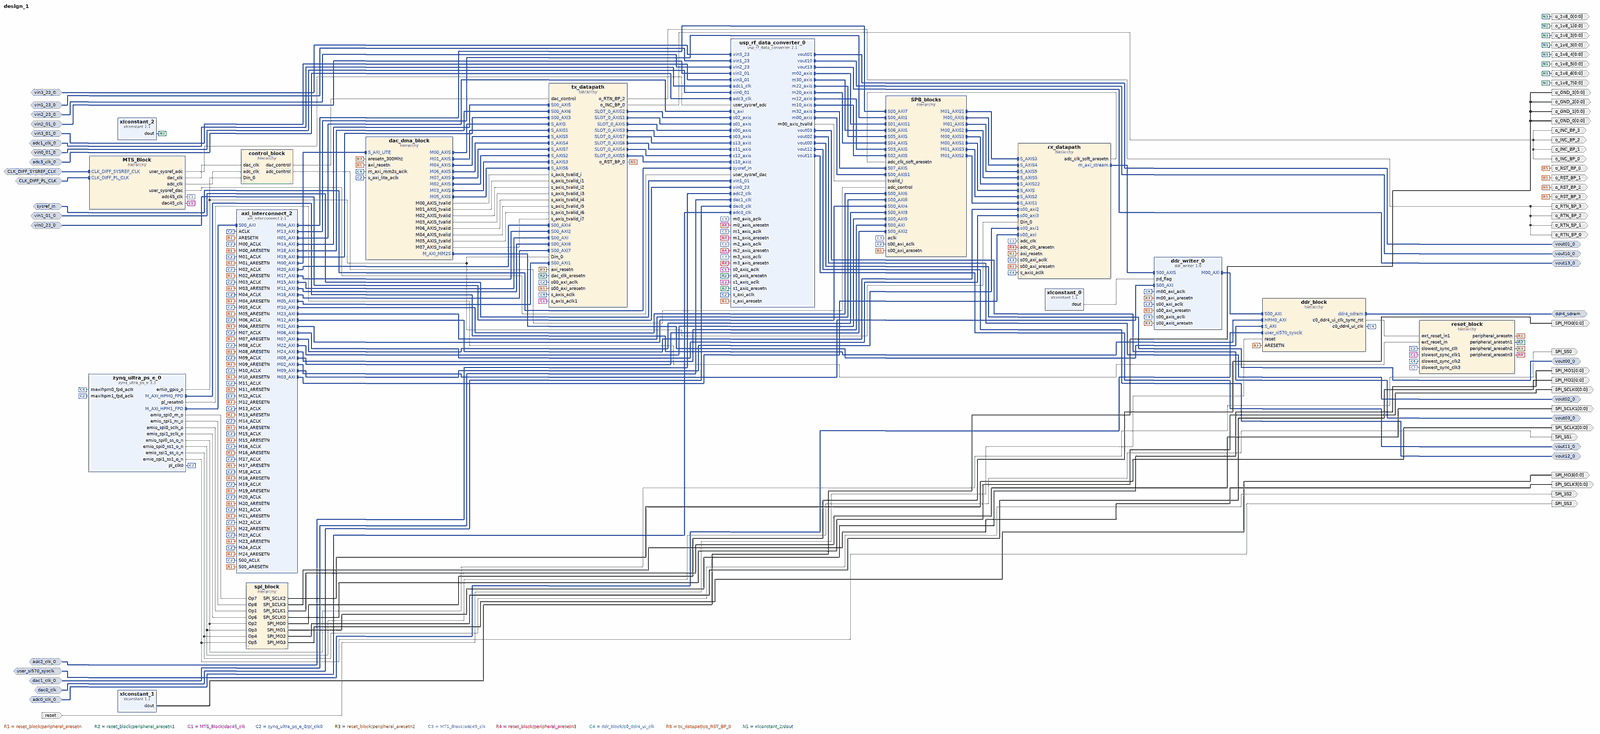
[diagram p0: block diagram of the top level, whole]
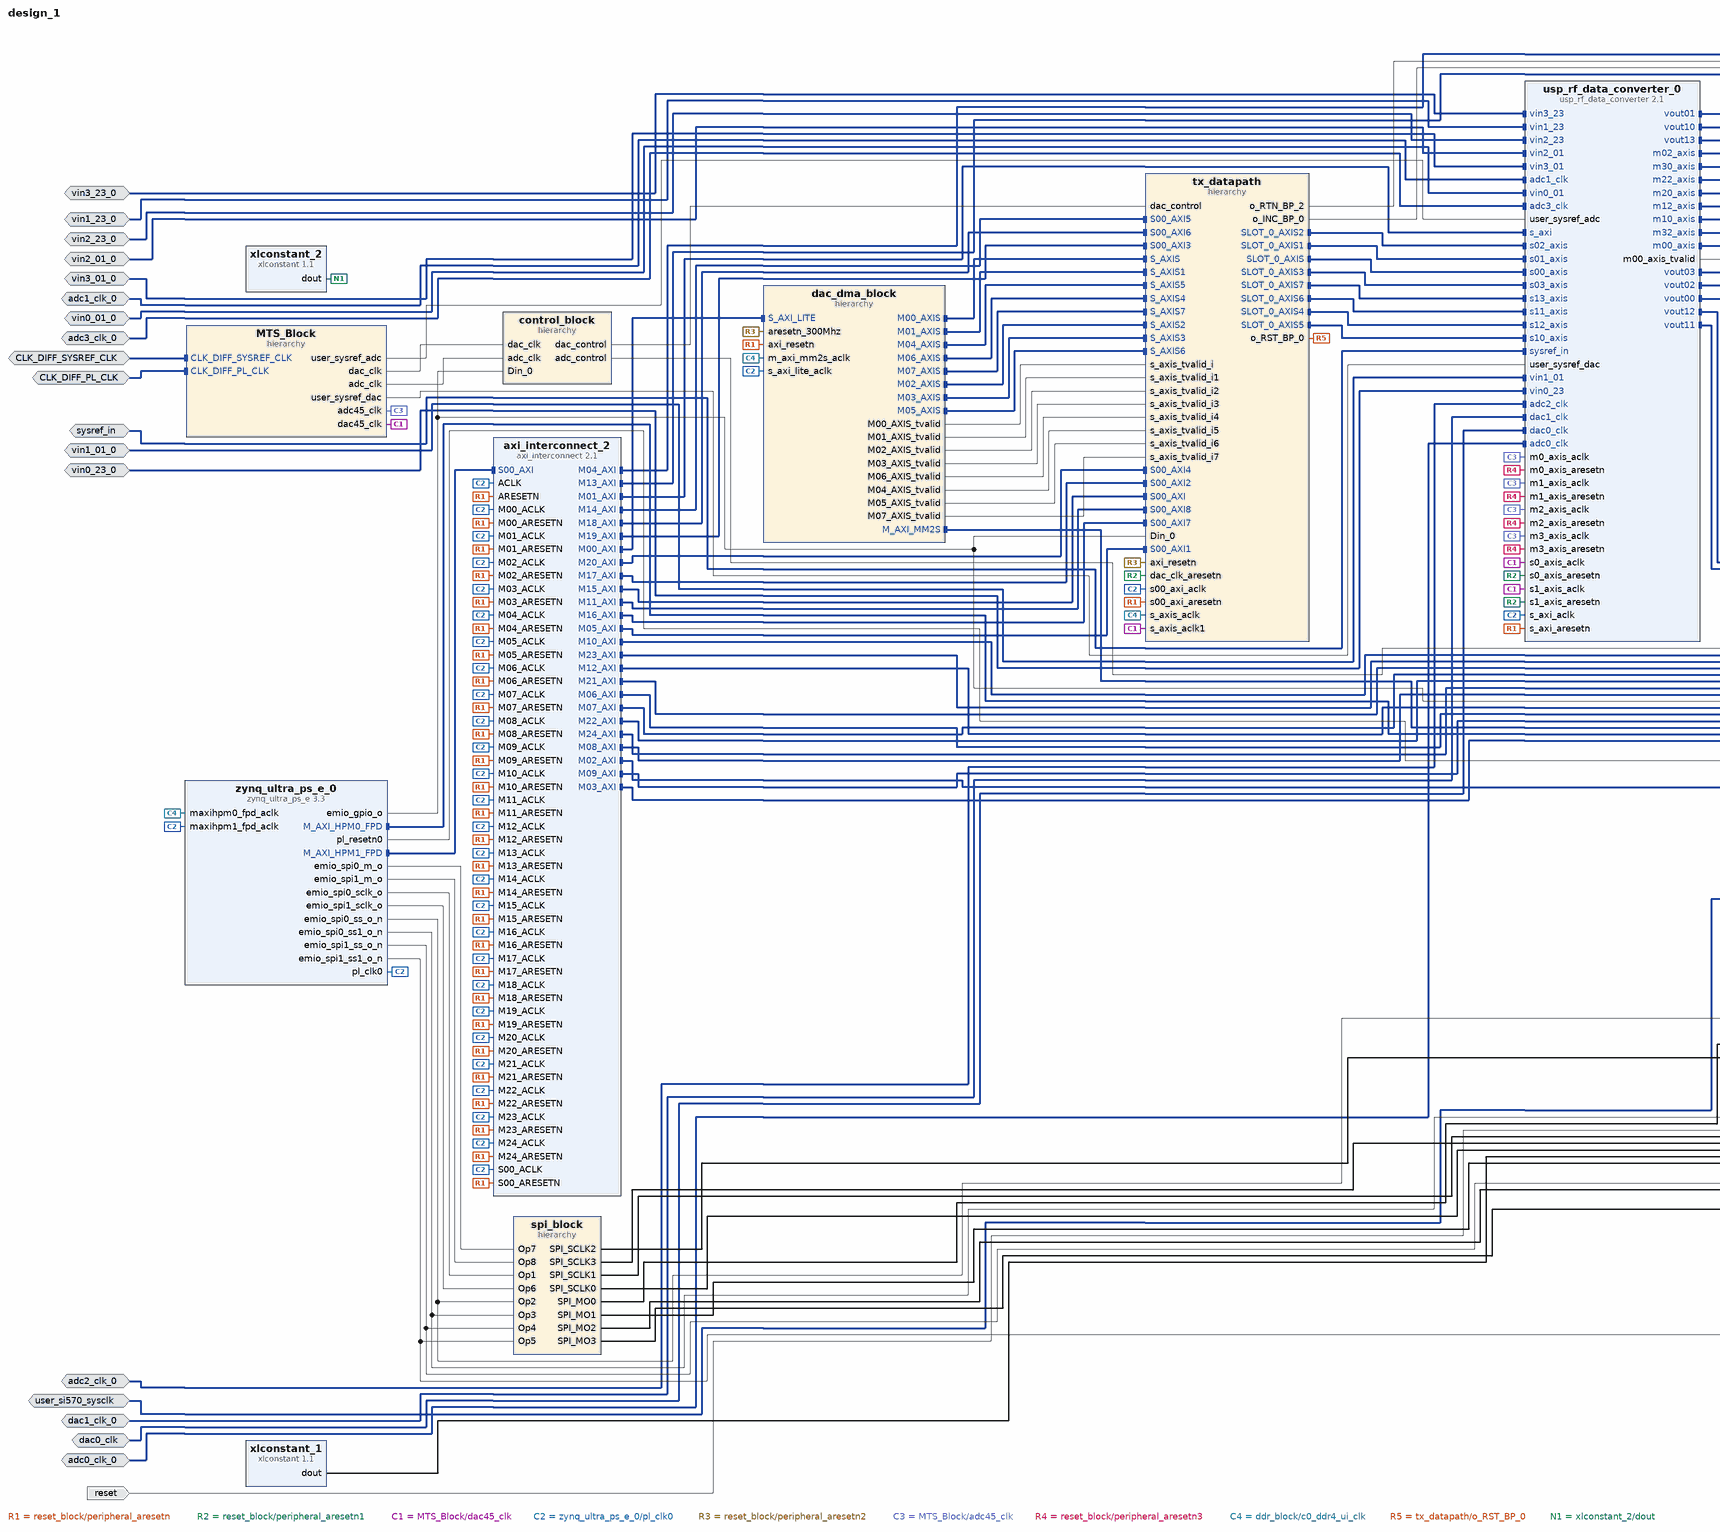
[diagram p1: block diagram of the top level, left part]
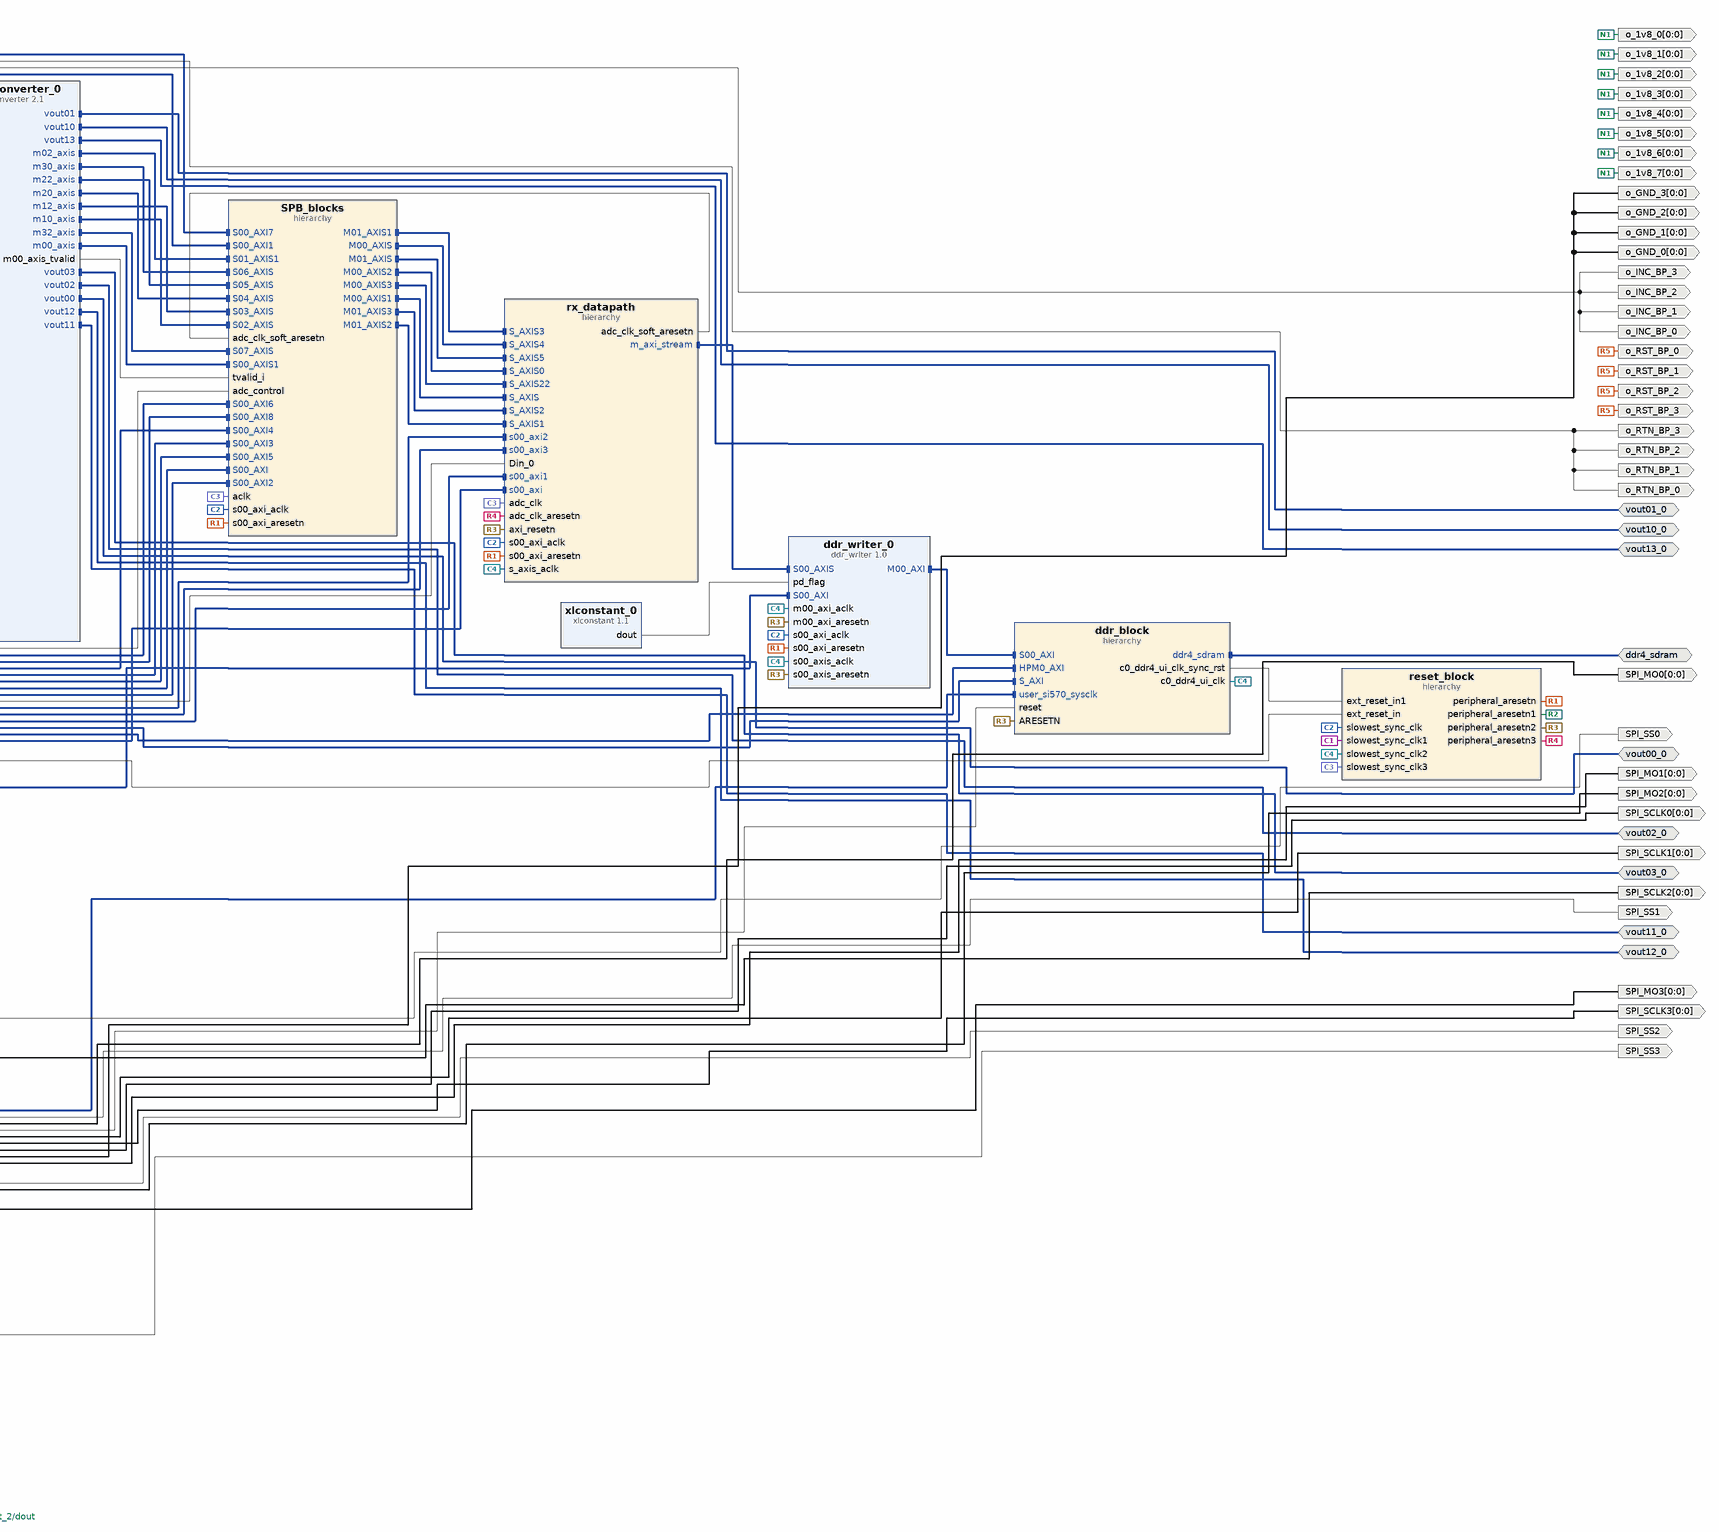
[diagram p2: block diagram of the top level, right part]
# Vivado block design design_1, xczu28dr-ffvg1517-2-e, Vivado 2019.1
create_bd_design design_1

create_bd_intf_port -mode Master -vlnv xilinx.com:interface:diff_analog_io_rtl:1.0 vout00_0
create_bd_intf_port -mode Slave -vlnv xilinx.com:display_usp_rf_data_converter:diff_pins_rtl:1.0 sysref_in
create_bd_intf_port -mode Slave -vlnv xilinx.com:interface:diff_clock_rtl:1.0 dac0_clk
create_bd_intf_port -mode Slave -vlnv xilinx.com:interface:diff_clock_rtl:1.0 CLK_DIFF_PL_CLK
set_property -dict {CONFIG.FREQ_HZ 110000000} [get_bd_intf_ports CLK_DIFF_PL_CLK]
create_bd_intf_port -mode Slave -vlnv xilinx.com:interface:diff_clock_rtl:1.0 user_si570_sysclk
set_property -dict {CONFIG.FREQ_HZ 300000000} [get_bd_intf_ports user_si570_sysclk]
create_bd_intf_port -mode Master -vlnv xilinx.com:interface:ddr4_rtl:1.0 ddr4_sdram
create_bd_intf_port -mode Slave -vlnv xilinx.com:interface:diff_clock_rtl:1.0 CLK_DIFF_SYSREF_CLK
set_property -dict {CONFIG.FREQ_HZ 110000000} [get_bd_intf_ports CLK_DIFF_SYSREF_CLK]
create_bd_intf_port -mode Master -vlnv xilinx.com:interface:diff_analog_io_rtl:1.0 vout01_0
create_bd_intf_port -mode Slave -vlnv xilinx.com:interface:diff_analog_io_rtl:1.0 vin2_01_0
create_bd_intf_port -mode Slave -vlnv xilinx.com:interface:diff_analog_io_rtl:1.0 vin2_23_0
create_bd_intf_port -mode Slave -vlnv xilinx.com:interface:diff_clock_rtl:1.0 adc2_clk_0
create_bd_intf_port -mode Master -vlnv xilinx.com:interface:diff_analog_io_rtl:1.0 vout02_0
create_bd_intf_port -mode Master -vlnv xilinx.com:interface:diff_analog_io_rtl:1.0 vout03_0
create_bd_intf_port -mode Slave -vlnv xilinx.com:interface:diff_analog_io_rtl:1.0 vin3_01_0
create_bd_intf_port -mode Slave -vlnv xilinx.com:interface:diff_analog_io_rtl:1.0 vin3_23_0
create_bd_intf_port -mode Slave -vlnv xilinx.com:interface:diff_clock_rtl:1.0 adc3_clk_0
create_bd_intf_port -mode Slave -vlnv xilinx.com:interface:diff_clock_rtl:1.0 adc0_clk_0
create_bd_intf_port -mode Slave -vlnv xilinx.com:interface:diff_clock_rtl:1.0 adc1_clk_0
create_bd_intf_port -mode Slave -vlnv xilinx.com:interface:diff_clock_rtl:1.0 dac1_clk_0
create_bd_intf_port -mode Slave -vlnv xilinx.com:interface:diff_analog_io_rtl:1.0 vin0_01_0
create_bd_intf_port -mode Slave -vlnv xilinx.com:interface:diff_analog_io_rtl:1.0 vin0_23_0
create_bd_intf_port -mode Slave -vlnv xilinx.com:interface:diff_analog_io_rtl:1.0 vin1_01_0
create_bd_intf_port -mode Slave -vlnv xilinx.com:interface:diff_analog_io_rtl:1.0 vin1_23_0
create_bd_intf_port -mode Master -vlnv xilinx.com:interface:diff_analog_io_rtl:1.0 vout10_0
create_bd_intf_port -mode Master -vlnv xilinx.com:interface:diff_analog_io_rtl:1.0 vout11_0
create_bd_intf_port -mode Master -vlnv xilinx.com:interface:diff_analog_io_rtl:1.0 vout12_0
create_bd_intf_port -mode Master -vlnv xilinx.com:interface:diff_analog_io_rtl:1.0 vout13_0
create_bd_port -dir I -type rst reset
set_property -dict {CONFIG.POLARITY ACTIVE_HIGH} [get_bd_ports reset]
create_bd_port -dir O o_INC_BP_0
create_bd_port -dir O o_RST_BP_0
create_bd_port -dir O o_RTN_BP_0
create_bd_port -dir O o_INC_BP_1
create_bd_port -dir O o_RST_BP_1
create_bd_port -dir O o_RTN_BP_1
create_bd_port -dir O o_INC_BP_2
create_bd_port -dir O o_INC_BP_3
create_bd_port -dir O o_RST_BP_2
create_bd_port -dir O o_RST_BP_3
create_bd_port -dir O o_RTN_BP_2
create_bd_port -dir O o_RTN_BP_3
create_bd_port -dir O -from 0 -to 0 SPI_SCLK0
create_bd_port -dir O -from 0 -to 0 SPI_MO0
create_bd_port -dir O SPI_SS0
create_bd_port -dir O SPI_SS1
create_bd_port -dir O -from 0 -to 0 SPI_SCLK2
create_bd_port -dir O -from 0 -to 0 SPI_MO1
create_bd_port -dir O SPI_SS2
create_bd_port -dir O SPI_SS3
create_bd_port -dir O -from 0 -to 0 SPI_MO2
create_bd_port -dir O -from 0 -to 0 SPI_MO3
create_bd_port -dir O -from 0 -to 0 SPI_SCLK1
create_bd_port -dir O -from 0 -to 0 SPI_SCLK3
create_bd_port -dir O -from 0 -to 0 o_1v8_0
create_bd_port -dir O -from 0 -to 0 o_GND_0
create_bd_port -dir O -from 0 -to 0 o_GND_1
create_bd_port -dir O -from 0 -to 0 o_GND_2
create_bd_port -dir O -from 0 -to 0 o_GND_3
create_bd_port -dir O -from 0 -to 0 o_1v8_3
create_bd_port -dir O -from 0 -to 0 o_1v8_2
create_bd_port -dir O -from 0 -to 0 o_1v8_1
create_bd_port -dir O -from 0 -to 0 o_1v8_4
create_bd_port -dir O -from 0 -to 0 o_1v8_5
create_bd_port -dir O -from 0 -to 0 o_1v8_6
create_bd_port -dir O -from 0 -to 0 o_1v8_7

create_bd_cell -type ip -vlnv xilinx.com:ip:zynq_ultra_ps_e:3.3 zynq_ultra_ps_e_0
set_property -dict [list \
  CONFIG.PSU_BANK_0_IO_STANDARD LVCMOS18 \
  CONFIG.PSU_BANK_1_IO_STANDARD LVCMOS18 \
  CONFIG.PSU_BANK_2_IO_STANDARD LVCMOS18 \
  CONFIG.PSU_USB3__DUAL_CLOCK_ENABLE 1 \
  CONFIG.PSU__CAN1__PERIPHERAL__ENABLE 0 \
  CONFIG.PSU__CRF_APB__ACPU_CTRL__FREQMHZ 1200 \
  CONFIG.PSU__CRF_APB__ACPU_CTRL__SRCSEL APLL \
  CONFIG.PSU__CRF_APB__APLL_CTRL__SRCSEL PSS_REF_CLK \
  CONFIG.PSU__CRF_APB__DBG_FPD_CTRL__FREQMHZ 250 \
  CONFIG.PSU__CRF_APB__DBG_FPD_CTRL__SRCSEL IOPLL \
  CONFIG.PSU__CRF_APB__DBG_TRACE_CTRL__FREQMHZ 250 \
  CONFIG.PSU__CRF_APB__DBG_TRACE_CTRL__SRCSEL IOPLL \
  CONFIG.PSU__CRF_APB__DBG_TSTMP_CTRL__FREQMHZ 250 \
  CONFIG.PSU__CRF_APB__DBG_TSTMP_CTRL__SRCSEL IOPLL \
  CONFIG.PSU__CRF_APB__DDR_CTRL__FREQMHZ 1067 \
  CONFIG.PSU__CRF_APB__DDR_CTRL__SRCSEL DPLL \
  CONFIG.PSU__CRF_APB__DPDMA_REF_CTRL__FREQMHZ 600 \
  CONFIG.PSU__CRF_APB__DPDMA_REF_CTRL__SRCSEL APLL \
  CONFIG.PSU__CRF_APB__DPLL_CTRL__SRCSEL PSS_REF_CLK \
  CONFIG.PSU__CRF_APB__DP_AUDIO_REF_CTRL__SRCSEL RPLL \
  CONFIG.PSU__CRF_APB__DP_STC_REF_CTRL__SRCSEL RPLL \
  CONFIG.PSU__CRF_APB__DP_VIDEO_REF_CTRL__SRCSEL VPLL \
  CONFIG.PSU__CRF_APB__GDMA_REF_CTRL__FREQMHZ 600 \
  CONFIG.PSU__CRF_APB__GDMA_REF_CTRL__SRCSEL APLL \
  CONFIG.PSU__CRF_APB__GPU_REF_CTRL__FREQMHZ 500 \
  CONFIG.PSU__CRF_APB__GPU_REF_CTRL__SRCSEL IOPLL \
  CONFIG.PSU__CRF_APB__TOPSW_LSBUS_CTRL__FREQMHZ 100 \
  CONFIG.PSU__CRF_APB__TOPSW_LSBUS_CTRL__SRCSEL IOPLL \
  CONFIG.PSU__CRF_APB__TOPSW_MAIN_CTRL__FREQMHZ 533.33 \
  CONFIG.PSU__CRF_APB__TOPSW_MAIN_CTRL__SRCSEL DPLL \
  CONFIG.PSU__CRF_APB__VPLL_CTRL__SRCSEL PSS_REF_CLK \
  CONFIG.PSU__CRL_APB__ADMA_REF_CTRL__FREQMHZ 500 \
  CONFIG.PSU__CRL_APB__ADMA_REF_CTRL__SRCSEL IOPLL \
  CONFIG.PSU__CRL_APB__CAN1_REF_CTRL__FREQMHZ 100 \
  CONFIG.PSU__CRL_APB__CAN1_REF_CTRL__SRCSEL IOPLL \
  CONFIG.PSU__CRL_APB__CPU_R5_CTRL__FREQMHZ 500 \
  CONFIG.PSU__CRL_APB__CPU_R5_CTRL__SRCSEL IOPLL \
  CONFIG.PSU__CRL_APB__DBG_LPD_CTRL__FREQMHZ 250 \
  CONFIG.PSU__CRL_APB__DBG_LPD_CTRL__SRCSEL IOPLL \
  CONFIG.PSU__CRL_APB__GEM3_REF_CTRL__FREQMHZ 125 \
  CONFIG.PSU__CRL_APB__GEM3_REF_CTRL__SRCSEL IOPLL \
  CONFIG.PSU__CRL_APB__I2C0_REF_CTRL__FREQMHZ 100 \
  CONFIG.PSU__CRL_APB__I2C0_REF_CTRL__SRCSEL IOPLL \
  CONFIG.PSU__CRL_APB__I2C1_REF_CTRL__FREQMHZ 100 \
  CONFIG.PSU__CRL_APB__I2C1_REF_CTRL__SRCSEL IOPLL \
  CONFIG.PSU__CRL_APB__IOPLL_CTRL__SRCSEL PSS_REF_CLK \
  CONFIG.PSU__CRL_APB__IOU_SWITCH_CTRL__FREQMHZ 250 \
  CONFIG.PSU__CRL_APB__IOU_SWITCH_CTRL__SRCSEL IOPLL \
  CONFIG.PSU__CRL_APB__LPD_LSBUS_CTRL__FREQMHZ 100 \
  CONFIG.PSU__CRL_APB__LPD_LSBUS_CTRL__SRCSEL IOPLL \
  CONFIG.PSU__CRL_APB__LPD_SWITCH_CTRL__FREQMHZ 500 \
  CONFIG.PSU__CRL_APB__LPD_SWITCH_CTRL__SRCSEL IOPLL \
  CONFIG.PSU__CRL_APB__PCAP_CTRL__FREQMHZ 200 \
  CONFIG.PSU__CRL_APB__PCAP_CTRL__SRCSEL IOPLL \
  CONFIG.PSU__CRL_APB__PL0_REF_CTRL__FREQMHZ 100 \
  CONFIG.PSU__CRL_APB__PL0_REF_CTRL__SRCSEL IOPLL \
  CONFIG.PSU__CRL_APB__QSPI_REF_CTRL__FREQMHZ 125 \
  CONFIG.PSU__CRL_APB__QSPI_REF_CTRL__SRCSEL IOPLL \
  CONFIG.PSU__CRL_APB__RPLL_CTRL__SRCSEL PSS_REF_CLK \
  CONFIG.PSU__CRL_APB__SDIO1_REF_CTRL__FREQMHZ 200 \
  CONFIG.PSU__CRL_APB__SDIO1_REF_CTRL__SRCSEL IOPLL \
  CONFIG.PSU__CRL_APB__TIMESTAMP_REF_CTRL__FREQMHZ 100 \
  CONFIG.PSU__CRL_APB__TIMESTAMP_REF_CTRL__SRCSEL IOPLL \
  CONFIG.PSU__CRL_APB__UART0_REF_CTRL__FREQMHZ 100 \
  CONFIG.PSU__CRL_APB__UART0_REF_CTRL__SRCSEL IOPLL \
  CONFIG.PSU__CRL_APB__UART1_REF_CTRL__FREQMHZ 100 \
  CONFIG.PSU__CRL_APB__UART1_REF_CTRL__SRCSEL IOPLL \
  CONFIG.PSU__CRL_APB__USB0_BUS_REF_CTRL__FREQMHZ 250 \
  CONFIG.PSU__CRL_APB__USB0_BUS_REF_CTRL__SRCSEL IOPLL \
  CONFIG.PSU__CRL_APB__USB3_DUAL_REF_CTRL__FREQMHZ 20 \
  CONFIG.PSU__CRL_APB__USB3_DUAL_REF_CTRL__SRCSEL IOPLL \
  CONFIG.PSU__CRL_APB__USB3__ENABLE 1 \
  CONFIG.PSU__CSUPMU__PERIPHERAL__VALID 1 \
  CONFIG.PSU__DDRC__BUS_WIDTH {64 Bit} \
  CONFIG.PSU__DDRC__COMPONENTS UDIMM \
  CONFIG.PSU__DDRC__DEVICE_CAPACITY {8192 MBits} \
  CONFIG.PSU__DDRC__DRAM_WIDTH {16 Bits} \
  CONFIG.PSU__DDRC__ECC Disabled \
  CONFIG.PSU__DDRC__MEMORY_TYPE {DDR 4} \
  CONFIG.PSU__DDRC__SPEED_BIN DDR4_2133P \
  CONFIG.PSU__DDR_HIGH_ADDRESS_GUI_ENABLE 1 \
  CONFIG.PSU__DDR__INTERFACE__FREQMHZ 533.500 \
  CONFIG.PSU__DISPLAYPORT__PERIPHERAL__ENABLE 0 \
  CONFIG.PSU__DLL__ISUSED 1 \
  CONFIG.PSU__ENET3__FIFO__ENABLE 0 \
  CONFIG.PSU__ENET3__GRP_MDIO__ENABLE 1 \
  CONFIG.PSU__ENET3__GRP_MDIO__IO {MIO 76 .. 77} \
  CONFIG.PSU__ENET3__PERIPHERAL__ENABLE 1 \
  CONFIG.PSU__ENET3__PERIPHERAL__IO {MIO 64 .. 75} \
  CONFIG.PSU__ENET3__PTP__ENABLE 0 \
  CONFIG.PSU__ENET3__TSU__ENABLE 0 \
  CONFIG.PSU__FPGA_PL0_ENABLE 1 \
  CONFIG.PSU__GEM3_COHERENCY 0 \
  CONFIG.PSU__GEM3_ROUTE_THROUGH_FPD 0 \
  CONFIG.PSU__GEM__TSU__ENABLE 0 \
  CONFIG.PSU__GPIO0_MIO__IO {MIO 0 .. 25} \
  CONFIG.PSU__GPIO0_MIO__PERIPHERAL__ENABLE 1 \
  CONFIG.PSU__GPIO1_MIO__IO {MIO 26 .. 51} \
  CONFIG.PSU__GPIO1_MIO__PERIPHERAL__ENABLE 1 \
  CONFIG.PSU__GPIO_EMIO_WIDTH 95 \
  CONFIG.PSU__GPIO_EMIO__PERIPHERAL__ENABLE 1 \
  CONFIG.PSU__GPIO_EMIO__PERIPHERAL__IO 95 \
  CONFIG.PSU__I2C0__PERIPHERAL__ENABLE 1 \
  CONFIG.PSU__I2C0__PERIPHERAL__IO {MIO 14 .. 15} \
  CONFIG.PSU__I2C1__PERIPHERAL__ENABLE 1 \
  CONFIG.PSU__I2C1__PERIPHERAL__IO {MIO 16 .. 17} \
  CONFIG.PSU__IOU_SLCR__IOU_TTC_APB_CLK__TTC0_SEL APB \
  CONFIG.PSU__IOU_SLCR__IOU_TTC_APB_CLK__TTC1_SEL APB \
  CONFIG.PSU__IOU_SLCR__IOU_TTC_APB_CLK__TTC2_SEL APB \
  CONFIG.PSU__IOU_SLCR__IOU_TTC_APB_CLK__TTC3_SEL APB \
  CONFIG.PSU__MAXIGP0__DATA_WIDTH 128 \
  CONFIG.PSU__OVERRIDE__BASIC_CLOCK 0 \
  CONFIG.PSU__PMU_COHERENCY 0 \
  CONFIG.PSU__PMU__AIBACK__ENABLE 0 \
  CONFIG.PSU__PMU__EMIO_GPI__ENABLE 0 \
  CONFIG.PSU__PMU__EMIO_GPO__ENABLE 0 \
  CONFIG.PSU__PMU__GPI0__ENABLE 0 \
  CONFIG.PSU__PMU__GPI1__ENABLE 0 \
  CONFIG.PSU__PMU__GPI2__ENABLE 0 \
  CONFIG.PSU__PMU__GPI3__ENABLE 0 \
  CONFIG.PSU__PMU__GPI4__ENABLE 0 \
  CONFIG.PSU__PMU__GPI5__ENABLE 0 \
  CONFIG.PSU__PMU__GPO0__ENABLE 0 \
  CONFIG.PSU__PMU__GPO1__ENABLE 0 \
  CONFIG.PSU__PMU__GPO2__ENABLE 0 \
  CONFIG.PSU__PMU__GPO3__ENABLE 0 \
  CONFIG.PSU__PMU__GPO4__ENABLE 0 \
  CONFIG.PSU__PMU__GPO5__ENABLE 0 \
  CONFIG.PSU__PMU__PERIPHERAL__ENABLE 1 \
  CONFIG.PSU__PMU__PLERROR__ENABLE 0 \
  CONFIG.PSU__PRESET_APPLIED 1 \
  CONFIG.PSU__PSS_REF_CLK__FREQMHZ 33.333 \
  CONFIG.PSU__QSPI_COHERENCY 0 \
  CONFIG.PSU__QSPI_ROUTE_THROUGH_FPD 0 \
  CONFIG.PSU__QSPI__GRP_FBCLK__ENABLE 1 \
  CONFIG.PSU__QSPI__GRP_FBCLK__IO {MIO 6} \
  CONFIG.PSU__QSPI__PERIPHERAL__DATA_MODE x4 \
  CONFIG.PSU__QSPI__PERIPHERAL__ENABLE 1 \
  CONFIG.PSU__QSPI__PERIPHERAL__IO {MIO 0 .. 12} \
  CONFIG.PSU__QSPI__PERIPHERAL__MODE {Dual Parallel} \
  CONFIG.PSU__SATA__PERIPHERAL__ENABLE 0 \
  CONFIG.PSU__SD1_COHERENCY 0 \
  CONFIG.PSU__SD1_ROUTE_THROUGH_FPD 0 \
  CONFIG.PSU__SD1__DATA_TRANSFER_MODE 8Bit \
  CONFIG.PSU__SD1__GRP_CD__ENABLE 1 \
  CONFIG.PSU__SD1__GRP_CD__IO {MIO 45} \
  CONFIG.PSU__SD1__GRP_POW__ENABLE 0 \
  CONFIG.PSU__SD1__GRP_WP__ENABLE 0 \
  CONFIG.PSU__SD1__PERIPHERAL__ENABLE 1 \
  CONFIG.PSU__SD1__PERIPHERAL__IO {MIO 39 .. 51} \
  CONFIG.PSU__SD1__SLOT_TYPE {SD 3.0} \
  CONFIG.PSU__SPI0__GRP_SS0__IO EMIO \
  CONFIG.PSU__SPI0__GRP_SS1__ENABLE 1 \
  CONFIG.PSU__SPI0__GRP_SS1__IO EMIO \
  CONFIG.PSU__SPI0__PERIPHERAL__ENABLE 1 \
  CONFIG.PSU__SPI0__PERIPHERAL__IO EMIO \
  CONFIG.PSU__SPI1__GRP_SS0__IO EMIO \
  CONFIG.PSU__SPI1__GRP_SS1__ENABLE 1 \
  CONFIG.PSU__SPI1__GRP_SS1__IO EMIO \
  CONFIG.PSU__SPI1__PERIPHERAL__ENABLE 1 \
  CONFIG.PSU__SPI1__PERIPHERAL__IO EMIO \
  CONFIG.PSU__SWDT0__CLOCK__ENABLE 0 \
  CONFIG.PSU__SWDT0__PERIPHERAL__ENABLE 1 \
  CONFIG.PSU__SWDT0__RESET__ENABLE 0 \
  CONFIG.PSU__SWDT1__CLOCK__ENABLE 0 \
  CONFIG.PSU__SWDT1__PERIPHERAL__ENABLE 1 \
  CONFIG.PSU__SWDT1__RESET__ENABLE 0 \
  CONFIG.PSU__TSU__BUFG_PORT_PAIR 0 \
  CONFIG.PSU__TTC0__CLOCK__ENABLE 0 \
  CONFIG.PSU__TTC0__PERIPHERAL__ENABLE 1 \
  CONFIG.PSU__TTC0__WAVEOUT__ENABLE 0 \
  CONFIG.PSU__TTC1__CLOCK__ENABLE 0 \
  CONFIG.PSU__TTC1__PERIPHERAL__ENABLE 1 \
  CONFIG.PSU__TTC1__WAVEOUT__ENABLE 0 \
  CONFIG.PSU__TTC2__CLOCK__ENABLE 0 \
  CONFIG.PSU__TTC2__PERIPHERAL__ENABLE 1 \
  CONFIG.PSU__TTC2__WAVEOUT__ENABLE 0 \
  CONFIG.PSU__TTC3__CLOCK__ENABLE 0 \
  CONFIG.PSU__TTC3__PERIPHERAL__ENABLE 1 \
  CONFIG.PSU__TTC3__WAVEOUT__ENABLE 0 \
  CONFIG.PSU__UART0__BAUD_RATE 115200 \
  CONFIG.PSU__UART0__MODEM__ENABLE 0 \
  CONFIG.PSU__UART0__PERIPHERAL__ENABLE 1 \
  CONFIG.PSU__UART0__PERIPHERAL__IO {MIO 18 .. 19} \
  CONFIG.PSU__UART1__PERIPHERAL__ENABLE 0 \
  CONFIG.PSU__USB0_COHERENCY 0 \
  CONFIG.PSU__USB0__PERIPHERAL__ENABLE 1 \
  CONFIG.PSU__USB0__PERIPHERAL__IO {MIO 52 .. 63} \
  CONFIG.PSU__USB0__REF_CLK_FREQ 26 \
  CONFIG.PSU__USB0__REF_CLK_SEL {Ref Clk2} \
  CONFIG.PSU__USB2_0__EMIO__ENABLE 0 \
  CONFIG.PSU__USB3_0__EMIO__ENABLE 0 \
  CONFIG.PSU__USB3_0__PERIPHERAL__ENABLE 1 \
  CONFIG.PSU__USB3_0__PERIPHERAL__IO {GT Lane2} \
  CONFIG.PSU__USB__RESET__MODE {Boot Pin} \
  CONFIG.PSU__USB__RESET__POLARITY {Active Low} \
  CONFIG.PSU__USE__IRQ0 1 \
  CONFIG.PSU__USE__M_AXI_GP0 1 \
  CONFIG.PSU__USE__M_AXI_GP1 1 \
  CONFIG.PSU__USE__M_AXI_GP2 0 \
  CONFIG.SUBPRESET1 Custom \
] [get_bd_cells zynq_ultra_ps_e_0]
# 123 more settings of zynq_ultra_ps_e_0 are not shown: defaults, MIO pin electricals, DDR timing, and values the tool derives
create_bd_cell -type hier MTS_Block
create_bd_cell -type hier reset_block
create_bd_cell -type hier dac_dma_block
create_bd_cell -type hier ddr_block
create_bd_cell -type ip -vlnv xilinx.com:ip:usp_rf_data_converter:2.1 usp_rf_data_converter_0
set_property -dict [list \
  CONFIG.ADC0_Multi_Tile_Sync true \
  CONFIG.ADC0_Outclk_Freq 27.500 \
  CONFIG.ADC0_Refclk_Freq 3520.000 \
  CONFIG.ADC0_Sampling_Rate 3.520 \
  CONFIG.ADC1_Multi_Tile_Sync true \
  CONFIG.ADC1_Outclk_Freq 27.500 \
  CONFIG.ADC1_Refclk_Freq 3520.000 \
  CONFIG.ADC1_Sampling_Rate 3.520 \
  CONFIG.ADC2_Multi_Tile_Sync true \
  CONFIG.ADC2_Outclk_Freq 27.500 \
  CONFIG.ADC2_Refclk_Freq 3520.000 \
  CONFIG.ADC2_Sampling_Rate 3.520 \
  CONFIG.ADC3_Multi_Tile_Sync true \
  CONFIG.ADC3_Outclk_Freq 27.500 \
  CONFIG.ADC3_Refclk_Freq 3520.000 \
  CONFIG.ADC3_Sampling_Rate 3.520 \
  CONFIG.ADC_Decimation_Mode00 1 \
  CONFIG.ADC_Decimation_Mode02 1 \
  CONFIG.ADC_Decimation_Mode10 1 \
  CONFIG.ADC_Decimation_Mode12 1 \
  CONFIG.ADC_Decimation_Mode20 1 \
  CONFIG.ADC_Decimation_Mode22 1 \
  CONFIG.ADC_Decimation_Mode30 1 \
  CONFIG.ADC_Decimation_Mode32 1 \
  CONFIG.ADC_Mixer_Type00 0 \
  CONFIG.ADC_Mixer_Type01 0 \
  CONFIG.ADC_Mixer_Type02 0 \
  CONFIG.ADC_Mixer_Type03 0 \
  CONFIG.ADC_Mixer_Type10 0 \
  CONFIG.ADC_Mixer_Type11 0 \
  CONFIG.ADC_Mixer_Type12 0 \
  CONFIG.ADC_Mixer_Type13 0 \
  CONFIG.ADC_Mixer_Type20 0 \
  CONFIG.ADC_Mixer_Type21 0 \
  CONFIG.ADC_Mixer_Type22 0 \
  CONFIG.ADC_Mixer_Type23 0 \
  CONFIG.ADC_Mixer_Type30 0 \
  CONFIG.ADC_Mixer_Type31 0 \
  CONFIG.ADC_Mixer_Type32 0 \
  CONFIG.ADC_Mixer_Type33 0 \
  CONFIG.ADC_Slice00_Enable true \
  CONFIG.ADC_Slice02_Enable true \
  CONFIG.ADC_Slice10_Enable true \
  CONFIG.ADC_Slice12_Enable true \
  CONFIG.ADC_Slice20_Enable true \
  CONFIG.ADC_Slice22_Enable true \
  CONFIG.ADC_Slice30_Enable true \
  CONFIG.ADC_Slice32_Enable true \
  CONFIG.DAC0_Multi_Tile_Sync true \
  CONFIG.DAC0_Outclk_Freq 220.000 \
  CONFIG.DAC0_Refclk_Freq 3520.000 \
  CONFIG.DAC0_Sampling_Rate 3.520 \
  CONFIG.DAC1_Multi_Tile_Sync true \
  CONFIG.DAC1_Outclk_Freq 220.000 \
  CONFIG.DAC1_Refclk_Freq 3520.000 \
  CONFIG.DAC1_Sampling_Rate 3.520 \
  CONFIG.DAC_Interpolation_Mode00 1 \
  CONFIG.DAC_Interpolation_Mode01 1 \
  CONFIG.DAC_Interpolation_Mode02 1 \
  CONFIG.DAC_Interpolation_Mode03 1 \
  CONFIG.DAC_Interpolation_Mode10 1 \
  CONFIG.DAC_Interpolation_Mode11 1 \
  CONFIG.DAC_Interpolation_Mode12 1 \
  CONFIG.DAC_Interpolation_Mode13 1 \
  CONFIG.DAC_Mixer_Type00 0 \
  CONFIG.DAC_Mixer_Type01 0 \
  CONFIG.DAC_Mixer_Type02 0 \
  CONFIG.DAC_Mixer_Type03 0 \
  CONFIG.DAC_Mixer_Type10 0 \
  CONFIG.DAC_Mixer_Type11 0 \
  CONFIG.DAC_Mixer_Type12 0 \
  CONFIG.DAC_Mixer_Type13 0 \
  CONFIG.DAC_Slice00_Enable true \
  CONFIG.DAC_Slice01_Enable true \
  CONFIG.DAC_Slice02_Enable true \
  CONFIG.DAC_Slice03_Enable true \
  CONFIG.DAC_Slice10_Enable true \
  CONFIG.DAC_Slice11_Enable true \
  CONFIG.DAC_Slice12_Enable true \
  CONFIG.DAC_Slice13_Enable true \
] [get_bd_cells usp_rf_data_converter_0]
create_bd_cell -type hier control_block
create_bd_cell -type ip -vlnv xilinx.com:ip:axi_interconnect:2.1 axi_interconnect_2
set_property -dict {CONFIG.NUM_MI 25} [get_bd_cells axi_interconnect_2]
create_bd_cell -type ip -vlnv xilinx.com:ip:xlconstant:1.1 xlconstant_0
set_property -dict {CONFIG.CONST_VAL 0} [get_bd_cells xlconstant_0]
create_bd_cell -type hier SPB_blocks
create_bd_cell -type hier rx_datapath
create_bd_cell -type hier tx_datapath
create_bd_cell -type ip -vlnv user.org:user:ddr_writer:1.0 ddr_writer_0
set_property -dict [list \
  CONFIG.C_M00_AXI_ADDR_WIDTH 64 \
  CONFIG.C_M00_AXI_ID_WIDTH 3 \
  CONFIG.C_M00_AXI_TARGET_SLAVE_BASE_ADDR 0x400010000 \
] [get_bd_cells ddr_writer_0]
create_bd_cell -type ip -vlnv xilinx.com:ip:xlconstant:1.1 xlconstant_1
set_property -dict {CONFIG.CONST_VAL 0} [get_bd_cells xlconstant_1]
create_bd_cell -type ip -vlnv xilinx.com:ip:xlconstant:1.1 xlconstant_2
create_bd_cell -type hier spi_block

# ---- hierarchy /MTS_Block ----
current_bd_instance /MTS_Block
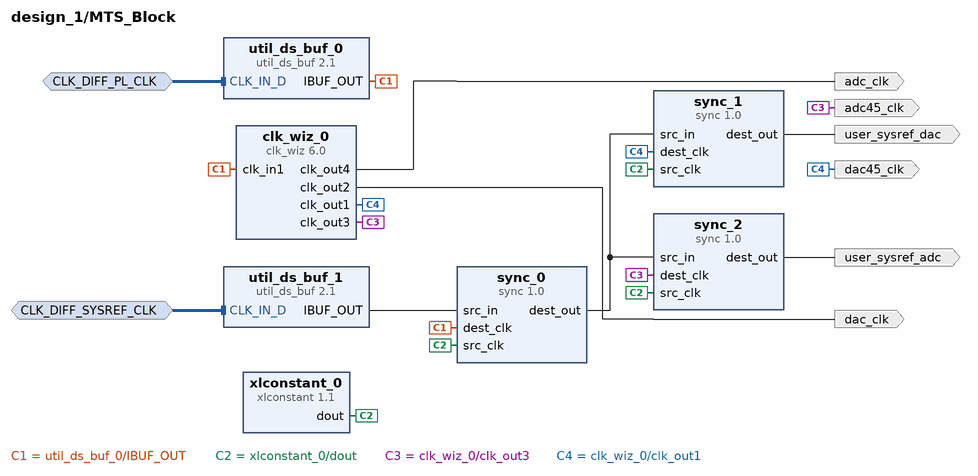
[diagram p3: block diagram inside /MTS_Block]
create_bd_intf_pin -mode Slave -vlnv xilinx.com:interface:diff_clock_rtl:1.0 CLK_DIFF_PL_CLK
create_bd_intf_pin -mode Slave -vlnv xilinx.com:interface:diff_clock_rtl:1.0 CLK_DIFF_SYSREF_CLK
create_bd_pin -dir O dac45_clk
create_bd_pin -dir O dac_clk
create_bd_pin -dir O user_sysref_dac
create_bd_pin -dir O user_sysref_adc
create_bd_pin -dir O adc45_clk
create_bd_pin -dir O adc_clk

create_bd_cell -type ip -vlnv xilinx.com:ip:util_ds_buf:2.1 util_ds_buf_0
create_bd_cell -type ip -vlnv xilinx.com:ip:clk_wiz:6.0 clk_wiz_0
set_property -dict [list \
  CONFIG.CLKIN1_JITTER_PS 90.89999999999999 \
  CONFIG.CLKOUT1_DRIVES Buffer \
  CONFIG.CLKOUT1_JITTER 116.681 \
  CONFIG.CLKOUT1_PHASE_ERROR 106.355 \
  CONFIG.CLKOUT1_REQUESTED_OUT_FREQ 220.000 \
  CONFIG.CLKOUT1_REQUESTED_PHASE 22.5 \
  CONFIG.CLKOUT2_DRIVES Buffer \
  CONFIG.CLKOUT2_JITTER 116.681 \
  CONFIG.CLKOUT2_PHASE_ERROR 106.355 \
  CONFIG.CLKOUT2_REQUESTED_OUT_FREQ 220.000 \
  CONFIG.CLKOUT2_REQUESTED_PHASE 0 \
  CONFIG.CLKOUT2_USED true \
  CONFIG.CLKOUT3_DRIVES Buffer \
  CONFIG.CLKOUT3_JITTER 102.539 \
  CONFIG.CLKOUT3_PHASE_ERROR 106.355 \
  CONFIG.CLKOUT3_REQUESTED_OUT_FREQ 440.000 \
  CONFIG.CLKOUT3_REQUESTED_PHASE 22.5 \
  CONFIG.CLKOUT3_USED true \
  CONFIG.CLKOUT4_DRIVES Buffer \
  CONFIG.CLKOUT4_JITTER 102.539 \
  CONFIG.CLKOUT4_PHASE_ERROR 106.355 \
  CONFIG.CLKOUT4_REQUESTED_OUT_FREQ 440.000 \
  CONFIG.CLKOUT4_USED true \
  CONFIG.CLKOUT5_DRIVES Buffer \
  CONFIG.CLKOUT6_DRIVES Buffer \
  CONFIG.CLKOUT7_DRIVES Buffer \
  CONFIG.ENABLE_CLOCK_MONITOR false \
  CONFIG.MMCM_CLKFBOUT_MULT_F 8.000 \
  CONFIG.MMCM_CLKIN1_PERIOD 9.091 \
  CONFIG.MMCM_CLKIN2_PERIOD 10.0 \
  CONFIG.MMCM_CLKOUT0_DIVIDE_F 4.000 \
  CONFIG.MMCM_CLKOUT0_PHASE 22.500 \
  CONFIG.MMCM_CLKOUT1_DIVIDE 4 \
  CONFIG.MMCM_CLKOUT1_PHASE 0.000 \
  CONFIG.MMCM_CLKOUT2_DIVIDE 2 \
  CONFIG.MMCM_CLKOUT2_PHASE 22.500 \
  CONFIG.MMCM_CLKOUT3_DIVIDE 2 \
  CONFIG.MMCM_DIVCLK_DIVIDE 1 \
  CONFIG.NUM_OUT_CLKS 4 \
  CONFIG.PRIMITIVE MMCM \
  CONFIG.PRIM_IN_FREQ 110.000 \
  CONFIG.SECONDARY_SOURCE Single_ended_clock_capable_pin \
  CONFIG.USE_LOCKED false \
  CONFIG.USE_PHASE_ALIGNMENT false \
  CONFIG.USE_RESET false \
] [get_bd_cells clk_wiz_0]
create_bd_cell -type ip -vlnv xilinx.com:ip:util_ds_buf:2.1 util_ds_buf_1
create_bd_cell -type ip -vlnv xilinx.com:user:sync:1.0 sync_0
set_property -dict {CONFIG.DEST_SYNC_FF 2 CONFIG.SRC_INPUT_REG 0} [get_bd_cells sync_0]
create_bd_cell -type ip -vlnv xilinx.com:user:sync:1.0 sync_1
set_property -dict {CONFIG.DEST_SYNC_FF 2 CONFIG.SRC_INPUT_REG 0} [get_bd_cells sync_1]
create_bd_cell -type ip -vlnv xilinx.com:ip:xlconstant:1.1 xlconstant_0
set_property -dict {CONFIG.CONST_VAL 0} [get_bd_cells xlconstant_0]
create_bd_cell -type ip -vlnv xilinx.com:user:sync:1.0 sync_2
set_property -dict {CONFIG.DEST_SYNC_FF 2 CONFIG.SRC_INPUT_REG 0} [get_bd_cells sync_2]

# ---- hierarchy /reset_block ----
current_bd_instance /reset_block
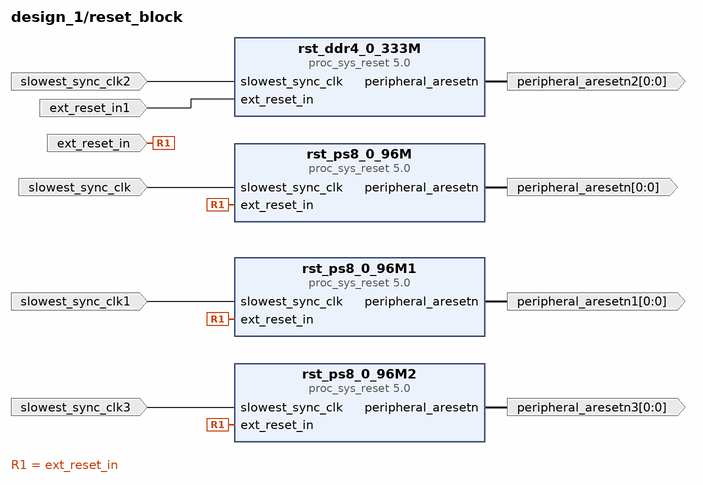
[diagram p4: block diagram inside /reset_block]
create_bd_pin -dir I -type clk slowest_sync_clk
create_bd_pin -dir I -type rst ext_reset_in
create_bd_pin -dir O -from 0 -to 0 -type rst peripheral_aresetn
create_bd_pin -dir I -type clk slowest_sync_clk1
create_bd_pin -dir O -from 0 -to 0 -type rst peripheral_aresetn1
create_bd_pin -dir O -from 0 -to 0 -type rst peripheral_aresetn2
create_bd_pin -dir I -type clk slowest_sync_clk2
create_bd_pin -dir I -type rst ext_reset_in1
create_bd_pin -dir O -from 0 -to 0 -type rst peripheral_aresetn3
create_bd_pin -dir I -type clk slowest_sync_clk3

create_bd_cell -type ip -vlnv xilinx.com:ip:proc_sys_reset:5.0 rst_ps8_0_96M
create_bd_cell -type ip -vlnv xilinx.com:ip:proc_sys_reset:5.0 rst_ps8_0_96M1
create_bd_cell -type ip -vlnv xilinx.com:ip:proc_sys_reset:5.0 rst_ddr4_0_333M
create_bd_cell -type ip -vlnv xilinx.com:ip:proc_sys_reset:5.0 rst_ps8_0_96M2

# ---- hierarchy /dac_dma_block ----
current_bd_instance /dac_dma_block
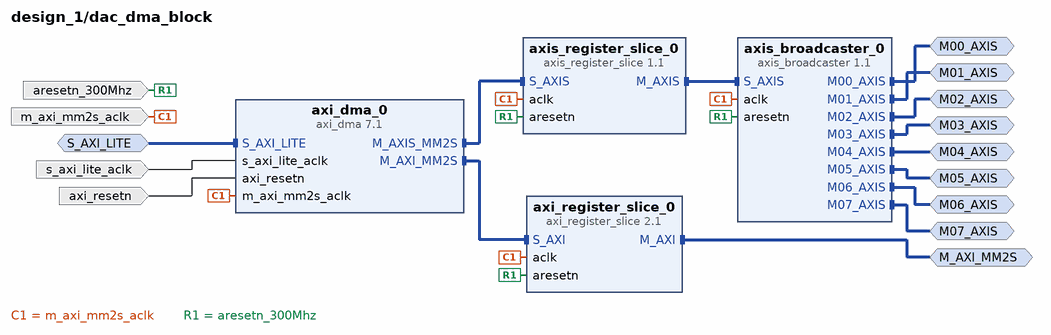
[diagram p5: block diagram inside /dac_dma_block]
create_bd_intf_pin -mode Slave -vlnv xilinx.com:interface:aximm_rtl:1.0 S_AXI_LITE
create_bd_intf_pin -mode Master -vlnv xilinx.com:interface:axis_rtl:1.0 M00_AXIS
create_bd_intf_pin -mode Master -vlnv xilinx.com:interface:axis_rtl:1.0 M01_AXIS
create_bd_intf_pin -mode Master -vlnv xilinx.com:interface:axis_rtl:1.0 M02_AXIS
create_bd_intf_pin -mode Master -vlnv xilinx.com:interface:axis_rtl:1.0 M03_AXIS
create_bd_intf_pin -mode Master -vlnv xilinx.com:interface:aximm_rtl:1.0 M_AXI_MM2S
create_bd_intf_pin -mode Master -vlnv xilinx.com:interface:axis_rtl:1.0 M04_AXIS
create_bd_intf_pin -mode Master -vlnv xilinx.com:interface:axis_rtl:1.0 M05_AXIS
create_bd_intf_pin -mode Master -vlnv xilinx.com:interface:axis_rtl:1.0 M06_AXIS
create_bd_intf_pin -mode Master -vlnv xilinx.com:interface:axis_rtl:1.0 M07_AXIS
create_bd_pin -dir I -type clk s_axi_lite_aclk
create_bd_pin -dir I -type clk m_axi_mm2s_aclk
create_bd_pin -dir I -type rst axi_resetn
create_bd_pin -dir I -type rst aresetn_300Mhz

create_bd_cell -type ip -vlnv xilinx.com:ip:axi_dma:7.1 axi_dma_0
set_property -dict [list \
  CONFIG.c_addr_width 64 \
  CONFIG.c_include_mm2s_dre 1 \
  CONFIG.c_include_s2mm 0 \
  CONFIG.c_include_sg 0 \
  CONFIG.c_m_axi_mm2s_data_width 512 \
  CONFIG.c_m_axis_mm2s_tdata_width 256 \
  CONFIG.c_mm2s_burst_size 64 \
  CONFIG.c_sg_length_width 26 \
] [get_bd_cells axi_dma_0]
create_bd_cell -type ip -vlnv xilinx.com:ip:axis_broadcaster:1.1 axis_broadcaster_0
set_property -dict [list \
  CONFIG.M02_TDATA_REMAP {tdata[255:0]} \
  CONFIG.M03_TDATA_REMAP {tdata[255:0]} \
  CONFIG.M04_TDATA_REMAP {tdata[255:0]} \
  CONFIG.M05_TDATA_REMAP {tdata[255:0]} \
  CONFIG.M06_TDATA_REMAP {tdata[255:0]} \
  CONFIG.M07_TDATA_REMAP {tdata[255:0]} \
  CONFIG.NUM_MI 8 \
] [get_bd_cells axis_broadcaster_0]
create_bd_cell -type ip -vlnv xilinx.com:ip:axi_register_slice:2.1 axi_register_slice_0
create_bd_cell -type ip -vlnv xilinx.com:ip:axis_register_slice:1.1 axis_register_slice_0

# ---- hierarchy /ddr_block ----
current_bd_instance /ddr_block
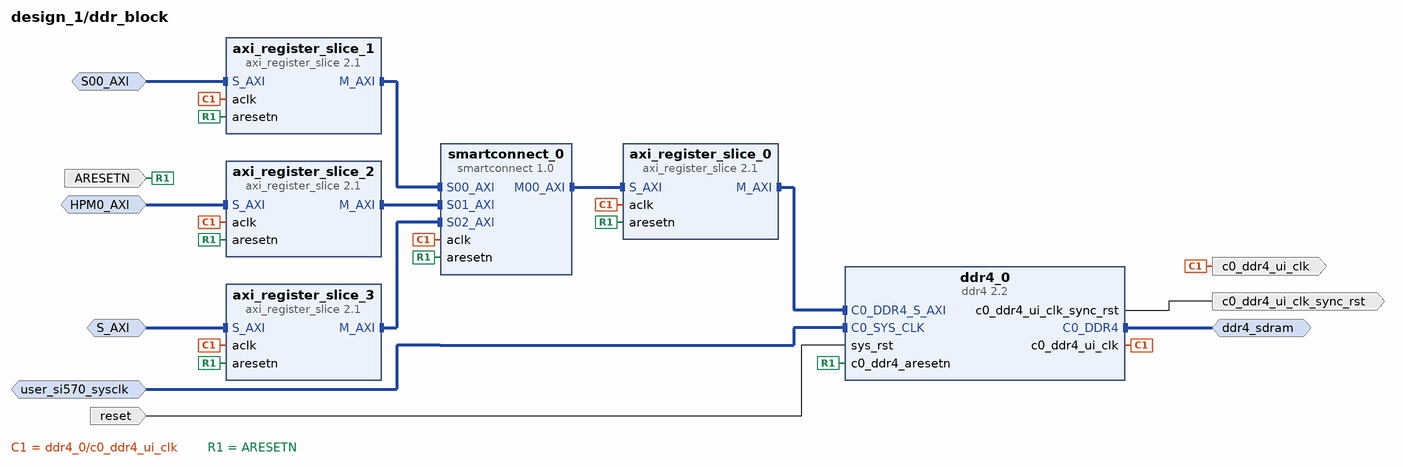
[diagram p6: block diagram inside /ddr_block]
create_bd_intf_pin -mode Slave -vlnv xilinx.com:interface:diff_clock_rtl:1.0 user_si570_sysclk
create_bd_intf_pin -mode Master -vlnv xilinx.com:interface:ddr4_rtl:1.0 ddr4_sdram
create_bd_intf_pin -mode Slave -vlnv xilinx.com:interface:aximm_rtl:1.0 S00_AXI
create_bd_intf_pin -mode Slave -vlnv xilinx.com:interface:aximm_rtl:1.0 HPM0_AXI
create_bd_intf_pin -mode Slave -vlnv xilinx.com:interface:aximm_rtl:1.0 S_AXI
create_bd_pin -dir O -type clk c0_ddr4_ui_clk
create_bd_pin -dir I -type rst ARESETN
create_bd_pin -dir O -type rst c0_ddr4_ui_clk_sync_rst
create_bd_pin -dir I -type rst reset

create_bd_cell -type ip -vlnv xilinx.com:ip:ddr4:2.2 ddr4_0
set_property -dict [list \
  CONFIG.C0.DDR4_AUTO_AP_COL_A3 false \
  CONFIG.C0.DDR4_AxiArbitrationScheme RD_PRI_REG \
  CONFIG.C0.DDR4_Mem_Add_Map ROW_COLUMN_BANK \
  CONFIG.C0.DDR4_SAVE_RESTORE false \
  CONFIG.C0.DDR4_SELF_REFRESH false \
  CONFIG.C0.DDR4_UserRefresh_ZQCS false \
  CONFIG.C0.MIGRATION false \
  CONFIG.C0_CLOCK_BOARD_INTERFACE default_sysclk1_300mhz \
  CONFIG.C0_DDR4_BOARD_INTERFACE ddr4_sdram \
  CONFIG.Debug_Signal Disable \
  CONFIG.RESET_BOARD_INTERFACE reset \
  CONFIG.TIMING_OP2 true \
] [get_bd_cells ddr4_0]
create_bd_cell -type ip -vlnv xilinx.com:ip:smartconnect:1.0 smartconnect_0
set_property -dict {CONFIG.NUM_CLKS 1 CONFIG.NUM_SI 3} [get_bd_cells smartconnect_0]
create_bd_cell -type ip -vlnv xilinx.com:ip:axi_register_slice:2.1 axi_register_slice_0
create_bd_cell -type ip -vlnv xilinx.com:ip:axi_register_slice:2.1 axi_register_slice_1
create_bd_cell -type ip -vlnv xilinx.com:ip:axi_register_slice:2.1 axi_register_slice_2
create_bd_cell -type ip -vlnv xilinx.com:ip:axi_register_slice:2.1 axi_register_slice_3

# ---- hierarchy /control_block ----
current_bd_instance /control_block
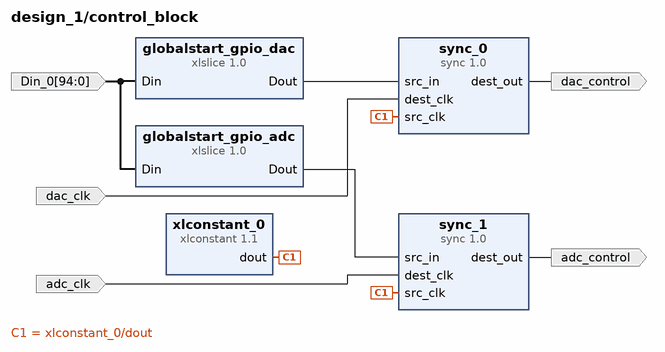
[diagram p7: block diagram inside /control_block]
create_bd_pin -dir I -from 94 -to 0 Din_0
create_bd_pin -dir I -type clk dac_clk
create_bd_pin -dir O dac_control
create_bd_pin -dir O adc_control
create_bd_pin -dir I -type clk adc_clk

create_bd_cell -type ip -vlnv xilinx.com:ip:xlslice:1.0 globalstart_gpio_dac
set_property -dict [list \
  CONFIG.DIN_FROM 24 \
  CONFIG.DIN_TO 24 \
  CONFIG.DIN_WIDTH 95 \
  CONFIG.DOUT_WIDTH 1 \
] [get_bd_cells globalstart_gpio_dac]
create_bd_cell -type ip -vlnv xilinx.com:user:sync:1.0 sync_0
set_property -dict {CONFIG.DEST_SYNC_FF 2 CONFIG.SRC_INPUT_REG 0} [get_bd_cells sync_0]
create_bd_cell -type ip -vlnv xilinx.com:ip:xlconstant:1.1 xlconstant_0
set_property -dict {CONFIG.CONST_VAL 0} [get_bd_cells xlconstant_0]
create_bd_cell -type ip -vlnv xilinx.com:user:sync:1.0 sync_1
set_property -dict {CONFIG.DEST_SYNC_FF 2 CONFIG.SRC_INPUT_REG 0} [get_bd_cells sync_1]
create_bd_cell -type ip -vlnv xilinx.com:ip:xlslice:1.0 globalstart_gpio_adc
set_property -dict [list \
  CONFIG.DIN_FROM 41 \
  CONFIG.DIN_TO 41 \
  CONFIG.DIN_WIDTH 95 \
  CONFIG.DOUT_WIDTH 1 \
] [get_bd_cells globalstart_gpio_adc]

# ---- hierarchy /SPB_blocks ----
current_bd_instance /SPB_blocks
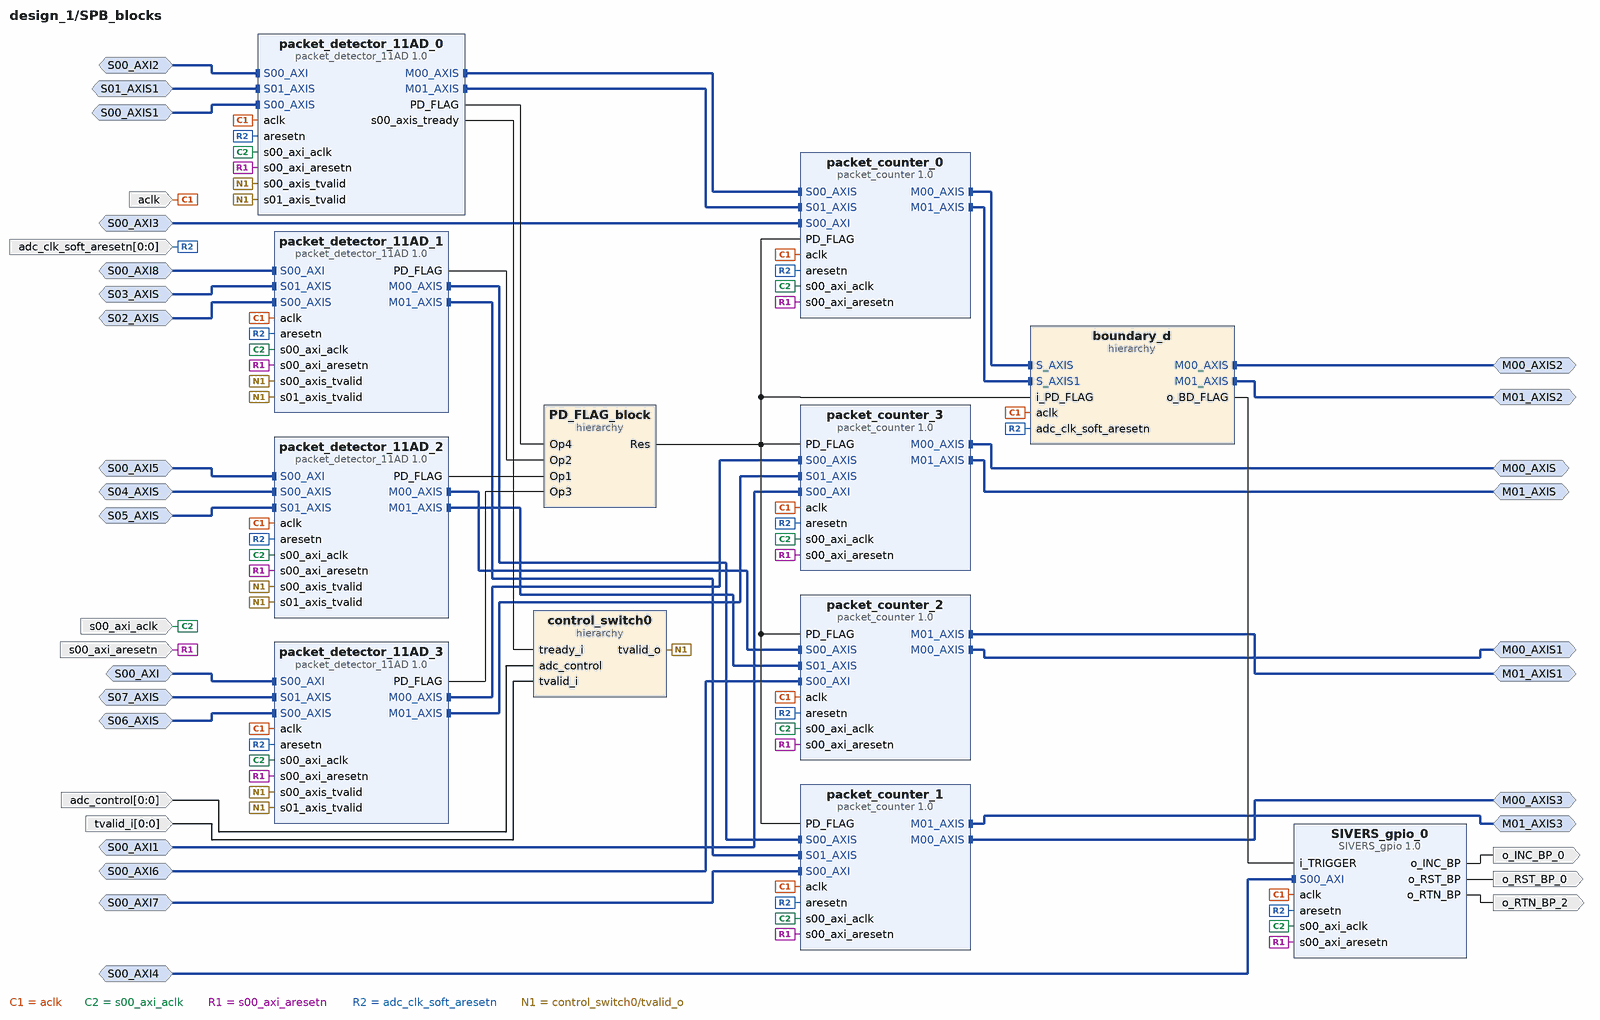
[diagram p8: block diagram inside /SPB_blocks]
create_bd_intf_pin -mode Slave -vlnv xilinx.com:interface:axis_rtl:1.0 S07_AXIS
create_bd_intf_pin -mode Slave -vlnv xilinx.com:interface:axis_rtl:1.0 S06_AXIS
create_bd_intf_pin -mode Slave -vlnv xilinx.com:interface:aximm_rtl:1.0 S00_AXI
create_bd_intf_pin -mode Slave -vlnv xilinx.com:interface:aximm_rtl:1.0 S00_AXI1
create_bd_intf_pin -mode Slave -vlnv xilinx.com:interface:axis_rtl:1.0 S00_AXIS1
create_bd_intf_pin -mode Slave -vlnv xilinx.com:interface:axis_rtl:1.0 S01_AXIS1
create_bd_intf_pin -mode Slave -vlnv xilinx.com:interface:aximm_rtl:1.0 S00_AXI2
create_bd_intf_pin -mode Slave -vlnv xilinx.com:interface:aximm_rtl:1.0 S00_AXI3
create_bd_intf_pin -mode Slave -vlnv xilinx.com:interface:aximm_rtl:1.0 S00_AXI4
create_bd_intf_pin -mode Slave -vlnv xilinx.com:interface:axis_rtl:1.0 S05_AXIS
create_bd_intf_pin -mode Slave -vlnv xilinx.com:interface:axis_rtl:1.0 S04_AXIS
create_bd_intf_pin -mode Slave -vlnv xilinx.com:interface:aximm_rtl:1.0 S00_AXI5
create_bd_intf_pin -mode Slave -vlnv xilinx.com:interface:aximm_rtl:1.0 S00_AXI6
create_bd_intf_pin -mode Slave -vlnv xilinx.com:interface:aximm_rtl:1.0 S00_AXI7
create_bd_intf_pin -mode Slave -vlnv xilinx.com:interface:axis_rtl:1.0 S03_AXIS
create_bd_intf_pin -mode Slave -vlnv xilinx.com:interface:axis_rtl:1.0 S02_AXIS
create_bd_intf_pin -mode Slave -vlnv xilinx.com:interface:aximm_rtl:1.0 S00_AXI8
create_bd_intf_pin -mode Master -vlnv xilinx.com:interface:axis_rtl:1.0 M00_AXIS2
create_bd_intf_pin -mode Master -vlnv xilinx.com:interface:axis_rtl:1.0 M01_AXIS2
create_bd_intf_pin -mode Master -vlnv xilinx.com:interface:axis_rtl:1.0 M00_AXIS3
create_bd_intf_pin -mode Master -vlnv xilinx.com:interface:axis_rtl:1.0 M01_AXIS3
create_bd_intf_pin -mode Master -vlnv xilinx.com:interface:axis_rtl:1.0 M00_AXIS1
create_bd_intf_pin -mode Master -vlnv xilinx.com:interface:axis_rtl:1.0 M01_AXIS1
create_bd_intf_pin -mode Master -vlnv xilinx.com:interface:axis_rtl:1.0 M00_AXIS
create_bd_intf_pin -mode Master -vlnv xilinx.com:interface:axis_rtl:1.0 M01_AXIS
create_bd_pin -dir I -type clk aclk
create_bd_pin -dir I -type clk s00_axi_aclk
create_bd_pin -dir I -type rst s00_axi_aresetn
create_bd_pin -dir I -from 0 -to 0 -type rst adc_clk_soft_aresetn
create_bd_pin -dir O o_INC_BP_0
create_bd_pin -dir O o_RST_BP_0
create_bd_pin -dir O o_RTN_BP_2
create_bd_pin -dir I -from 0 -to 0 adc_control
create_bd_pin -dir I -from 0 -to 0 tvalid_i

create_bd_cell -type ip -vlnv user.org:user:packet_counter:1.0 packet_counter_3
create_bd_cell -type ip -vlnv user.org:user:packet_counter:1.0 packet_counter_0
create_bd_cell -type ip -vlnv user.org:user:packet_counter:1.0 packet_counter_2
create_bd_cell -type ip -vlnv user.org:user:packet_counter:1.0 packet_counter_1
create_bd_cell -type hier PD_FLAG_block
create_bd_cell -type hier control_switch0
create_bd_cell -type hier boundary_d
create_bd_cell -type ip -vlnv user.org:user:SIVERS_gpio:1.0 SIVERS_gpio_0
create_bd_cell -type ip -vlnv user.org:user:packet_detector_11AD:1.0 packet_detector_11AD_0
create_bd_cell -type ip -vlnv user.org:user:packet_detector_11AD:1.0 packet_detector_11AD_2
create_bd_cell -type ip -vlnv user.org:user:packet_detector_11AD:1.0 packet_detector_11AD_1
create_bd_cell -type ip -vlnv user.org:user:packet_detector_11AD:1.0 packet_detector_11AD_3

# ---- hierarchy /SPB_blocks/PD_FLAG_block ----
current_bd_instance /SPB_blocks/PD_FLAG_block
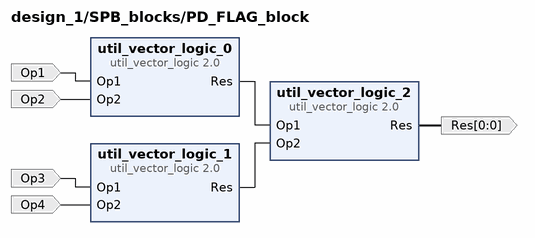
[diagram p9: block diagram inside /SPB_blocks/PD_FLAG_block]
create_bd_pin -dir I Op1
create_bd_pin -dir I Op2
create_bd_pin -dir I Op3
create_bd_pin -dir I Op4
create_bd_pin -dir O -from 0 -to 0 Res

create_bd_cell -type ip -vlnv xilinx.com:ip:util_vector_logic:2.0 util_vector_logic_0
set_property -dict {CONFIG.C_OPERATION or CONFIG.C_SIZE 1} [get_bd_cells util_vector_logic_0]
create_bd_cell -type ip -vlnv xilinx.com:ip:util_vector_logic:2.0 util_vector_logic_1
set_property -dict {CONFIG.C_OPERATION or CONFIG.C_SIZE 1} [get_bd_cells util_vector_logic_1]
create_bd_cell -type ip -vlnv xilinx.com:ip:util_vector_logic:2.0 util_vector_logic_2
set_property -dict {CONFIG.C_OPERATION or CONFIG.C_SIZE 1} [get_bd_cells util_vector_logic_2]

# ---- hierarchy /SPB_blocks/control_switch0 ----
current_bd_instance /SPB_blocks/control_switch0
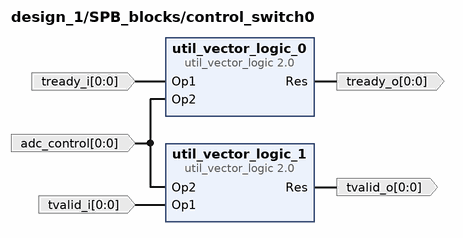
[diagram p10: block diagram inside /SPB_blocks/control_switch0]
create_bd_pin -dir I -from 0 -to 0 tvalid_i
create_bd_pin -dir O -from 0 -to 0 tready_o
create_bd_pin -dir I -from 0 -to 0 adc_control
create_bd_pin -dir I -from 0 -to 0 tready_i
create_bd_pin -dir O -from 0 -to 0 tvalid_o

create_bd_cell -type ip -vlnv xilinx.com:ip:util_vector_logic:2.0 util_vector_logic_0
set_property -dict {CONFIG.C_SIZE 1} [get_bd_cells util_vector_logic_0]
create_bd_cell -type ip -vlnv xilinx.com:ip:util_vector_logic:2.0 util_vector_logic_1
set_property -dict {CONFIG.C_SIZE 1} [get_bd_cells util_vector_logic_1]

# ---- hierarchy /SPB_blocks/boundary_d ----
current_bd_instance /SPB_blocks/boundary_d
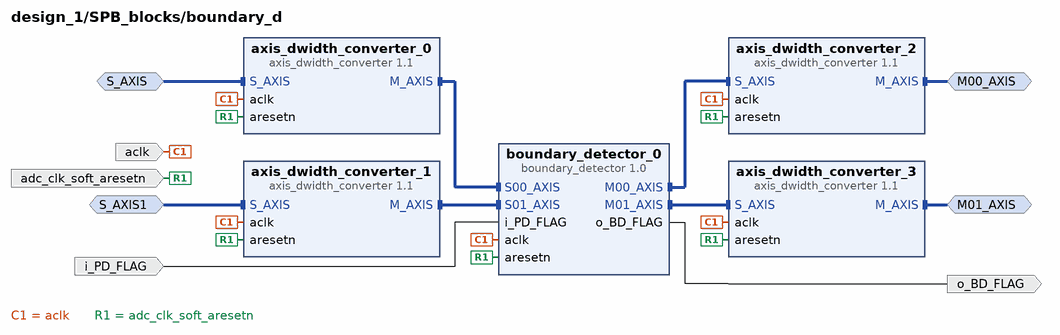
[diagram p11: block diagram inside /SPB_blocks/boundary_d]
create_bd_intf_pin -mode Slave -vlnv xilinx.com:interface:axis_rtl:1.0 S_AXIS
create_bd_intf_pin -mode Master -vlnv xilinx.com:interface:axis_rtl:1.0 M00_AXIS
create_bd_intf_pin -mode Master -vlnv xilinx.com:interface:axis_rtl:1.0 M01_AXIS
create_bd_intf_pin -mode Slave -vlnv xilinx.com:interface:axis_rtl:1.0 S_AXIS1
create_bd_pin -dir I -type clk aclk
create_bd_pin -dir I -type rst adc_clk_soft_aresetn
create_bd_pin -dir I i_PD_FLAG
create_bd_pin -dir O o_BD_FLAG

create_bd_cell -type ip -vlnv xilinx.com:ip:axis_dwidth_converter:1.1 axis_dwidth_converter_0
set_property -dict {CONFIG.M_TDATA_NUM_BYTES 32} [get_bd_cells axis_dwidth_converter_0]
create_bd_cell -type ip -vlnv xilinx.com:ip:axis_dwidth_converter:1.1 axis_dwidth_converter_2
set_property -dict {CONFIG.M_TDATA_NUM_BYTES 16} [get_bd_cells axis_dwidth_converter_2]
create_bd_cell -type ip -vlnv xilinx.com:ip:axis_dwidth_converter:1.1 axis_dwidth_converter_3
set_property -dict {CONFIG.M_TDATA_NUM_BYTES 16} [get_bd_cells axis_dwidth_converter_3]
create_bd_cell -type ip -vlnv xilinx.com:ip:axis_dwidth_converter:1.1 axis_dwidth_converter_1
set_property -dict {CONFIG.M_TDATA_NUM_BYTES 32} [get_bd_cells axis_dwidth_converter_1]
create_bd_cell -type ip -vlnv user.org:user:boundary_detector:1.0 boundary_detector_0

# ---- hierarchy /rx_datapath ----
current_bd_instance /rx_datapath
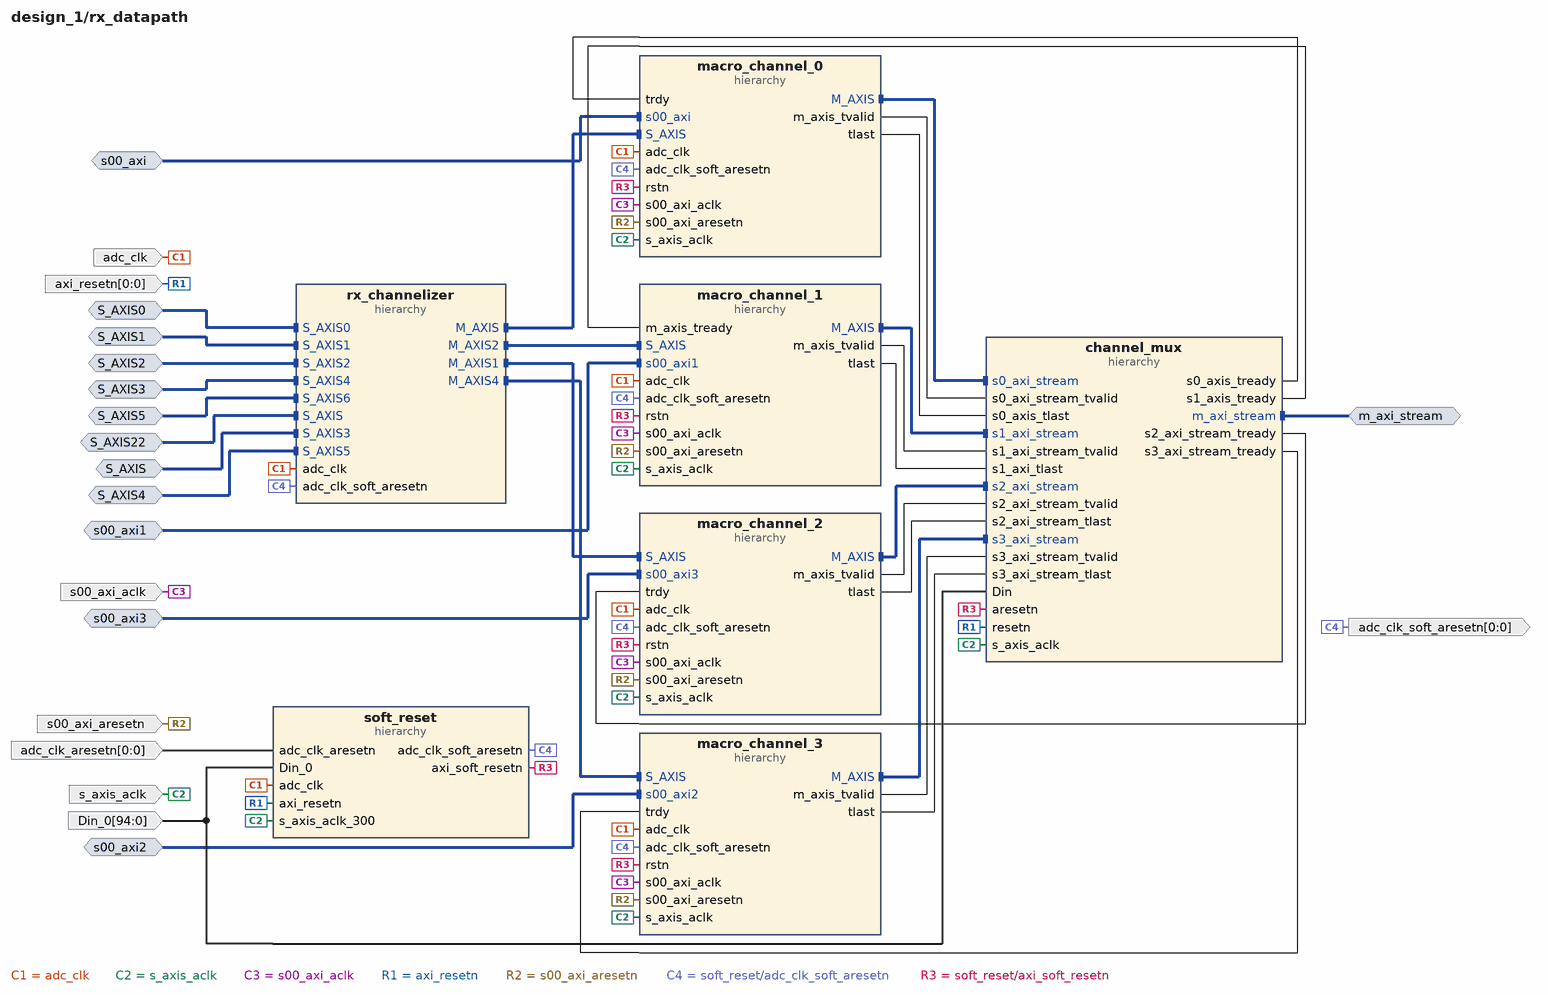
[diagram p12: block diagram inside /rx_datapath]
create_bd_intf_pin -mode Slave -vlnv xilinx.com:interface:aximm_rtl:1.0 s00_axi2
create_bd_intf_pin -mode Master -vlnv xilinx.com:interface:axis_rtl:1.0 m_axi_stream
create_bd_intf_pin -mode Slave -vlnv xilinx.com:interface:axis_rtl:1.0 S_AXIS0
create_bd_intf_pin -mode Slave -vlnv xilinx.com:interface:axis_rtl:1.0 S_AXIS1
create_bd_intf_pin -mode Slave -vlnv xilinx.com:interface:axis_rtl:1.0 S_AXIS22
create_bd_intf_pin -mode Slave -vlnv xilinx.com:interface:axis_rtl:1.0 S_AXIS2
create_bd_intf_pin -mode Slave -vlnv xilinx.com:interface:axis_rtl:1.0 S_AXIS
create_bd_intf_pin -mode Slave -vlnv xilinx.com:interface:axis_rtl:1.0 S_AXIS3
create_bd_intf_pin -mode Slave -vlnv xilinx.com:interface:axis_rtl:1.0 S_AXIS4
create_bd_intf_pin -mode Slave -vlnv xilinx.com:interface:axis_rtl:1.0 S_AXIS5
create_bd_intf_pin -mode Slave -vlnv xilinx.com:interface:aximm_rtl:1.0 s00_axi
create_bd_intf_pin -mode Slave -vlnv xilinx.com:interface:aximm_rtl:1.0 s00_axi1
create_bd_intf_pin -mode Slave -vlnv xilinx.com:interface:aximm_rtl:1.0 s00_axi3
create_bd_pin -dir I -type clk adc_clk
create_bd_pin -dir I -type clk s_axis_aclk
create_bd_pin -dir I -from 0 -to 0 adc_clk_aresetn
create_bd_pin -dir I -type clk s00_axi_aclk
create_bd_pin -dir I -from 94 -to 0 Din_0
create_bd_pin -dir I -from 0 -to 0 axi_resetn
create_bd_pin -dir I -type rst s00_axi_aresetn
create_bd_pin -dir O -from 0 -to 0 -type rst adc_clk_soft_aresetn

create_bd_cell -type hier rx_channelizer
create_bd_cell -type hier channel_mux
create_bd_cell -type hier soft_reset
create_bd_cell -type hier macro_channel_0
create_bd_cell -type hier macro_channel_1
create_bd_cell -type hier macro_channel_2
create_bd_cell -type hier macro_channel_3

# ---- hierarchy /rx_datapath/rx_channelizer ----
current_bd_instance /rx_datapath/rx_channelizer
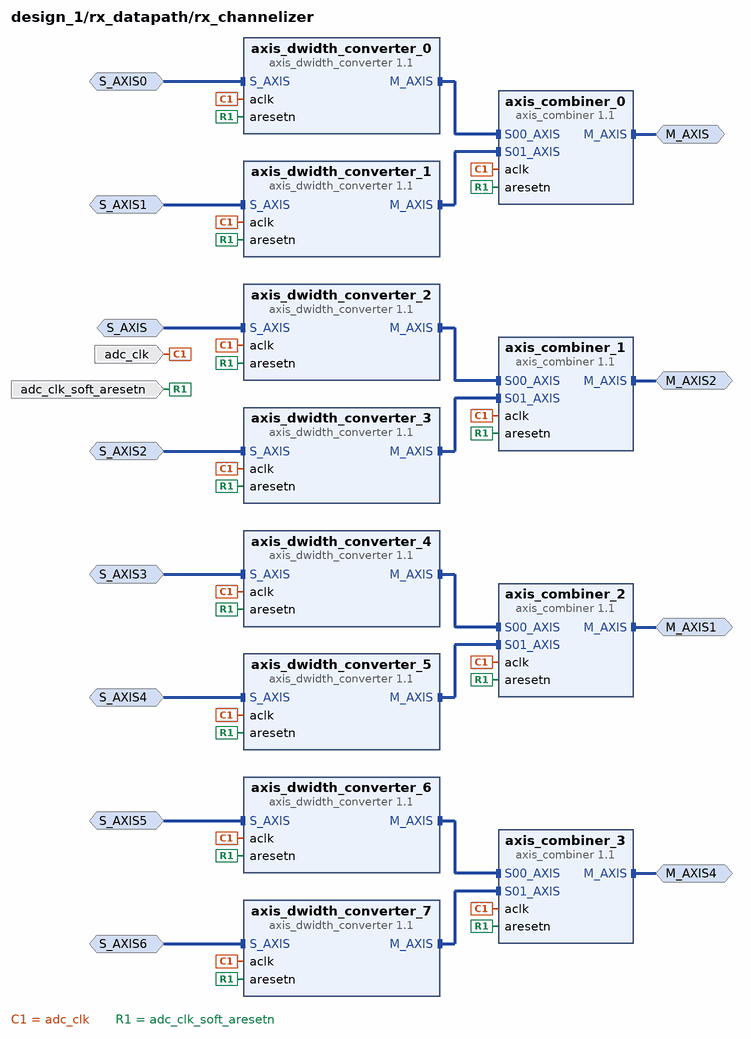
[diagram p13: block diagram inside /rx_datapath/rx_channelizer]
create_bd_intf_pin -mode Slave -vlnv xilinx.com:interface:axis_rtl:1.0 S_AXIS0
create_bd_intf_pin -mode Slave -vlnv xilinx.com:interface:axis_rtl:1.0 S_AXIS1
create_bd_intf_pin -mode Slave -vlnv xilinx.com:interface:axis_rtl:1.0 S_AXIS
create_bd_intf_pin -mode Slave -vlnv xilinx.com:interface:axis_rtl:1.0 S_AXIS2
create_bd_intf_pin -mode Slave -vlnv xilinx.com:interface:axis_rtl:1.0 S_AXIS3
create_bd_intf_pin -mode Slave -vlnv xilinx.com:interface:axis_rtl:1.0 S_AXIS4
create_bd_intf_pin -mode Slave -vlnv xilinx.com:interface:axis_rtl:1.0 S_AXIS5
create_bd_intf_pin -mode Slave -vlnv xilinx.com:interface:axis_rtl:1.0 S_AXIS6
create_bd_intf_pin -mode Master -vlnv xilinx.com:interface:axis_rtl:1.0 M_AXIS
create_bd_intf_pin -mode Master -vlnv xilinx.com:interface:axis_rtl:1.0 M_AXIS1
create_bd_intf_pin -mode Master -vlnv xilinx.com:interface:axis_rtl:1.0 M_AXIS4
create_bd_intf_pin -mode Master -vlnv xilinx.com:interface:axis_rtl:1.0 M_AXIS2
create_bd_pin -dir I -type clk adc_clk
create_bd_pin -dir I -type rst adc_clk_soft_aresetn

create_bd_cell -type ip -vlnv xilinx.com:ip:axis_dwidth_converter:1.1 axis_dwidth_converter_0
set_property -dict {CONFIG.M_TDATA_NUM_BYTES 32} [get_bd_cells axis_dwidth_converter_0]
create_bd_cell -type ip -vlnv xilinx.com:ip:axis_dwidth_converter:1.1 axis_dwidth_converter_1
set_property -dict {CONFIG.M_TDATA_NUM_BYTES 32} [get_bd_cells axis_dwidth_converter_1]
create_bd_cell -type ip -vlnv xilinx.com:ip:axis_dwidth_converter:1.1 axis_dwidth_converter_2
set_property -dict {CONFIG.M_TDATA_NUM_BYTES 32} [get_bd_cells axis_dwidth_converter_2]
create_bd_cell -type ip -vlnv xilinx.com:ip:axis_dwidth_converter:1.1 axis_dwidth_converter_3
set_property -dict {CONFIG.M_TDATA_NUM_BYTES 32} [get_bd_cells axis_dwidth_converter_3]
create_bd_cell -type ip -vlnv xilinx.com:ip:axis_dwidth_converter:1.1 axis_dwidth_converter_4
set_property -dict {CONFIG.M_TDATA_NUM_BYTES 32} [get_bd_cells axis_dwidth_converter_4]
create_bd_cell -type ip -vlnv xilinx.com:ip:axis_dwidth_converter:1.1 axis_dwidth_converter_5
set_property -dict {CONFIG.M_TDATA_NUM_BYTES 32} [get_bd_cells axis_dwidth_converter_5]
create_bd_cell -type ip -vlnv xilinx.com:ip:axis_dwidth_converter:1.1 axis_dwidth_converter_6
set_property -dict {CONFIG.M_TDATA_NUM_BYTES 32} [get_bd_cells axis_dwidth_converter_6]
create_bd_cell -type ip -vlnv xilinx.com:ip:axis_dwidth_converter:1.1 axis_dwidth_converter_7
set_property -dict {CONFIG.M_TDATA_NUM_BYTES 32} [get_bd_cells axis_dwidth_converter_7]
create_bd_cell -type ip -vlnv xilinx.com:ip:axis_combiner:1.1 axis_combiner_0
set_property -dict {CONFIG.TDATA_NUM_BYTES 32} [get_bd_cells axis_combiner_0]
create_bd_cell -type ip -vlnv xilinx.com:ip:axis_combiner:1.1 axis_combiner_2
set_property -dict {CONFIG.TDATA_NUM_BYTES 32} [get_bd_cells axis_combiner_2]
create_bd_cell -type ip -vlnv xilinx.com:ip:axis_combiner:1.1 axis_combiner_3
set_property -dict {CONFIG.TDATA_NUM_BYTES 32} [get_bd_cells axis_combiner_3]
create_bd_cell -type ip -vlnv xilinx.com:ip:axis_combiner:1.1 axis_combiner_1
set_property -dict {CONFIG.TDATA_NUM_BYTES 32} [get_bd_cells axis_combiner_1]

# ---- hierarchy /rx_datapath/channel_mux ----
current_bd_instance /rx_datapath/channel_mux
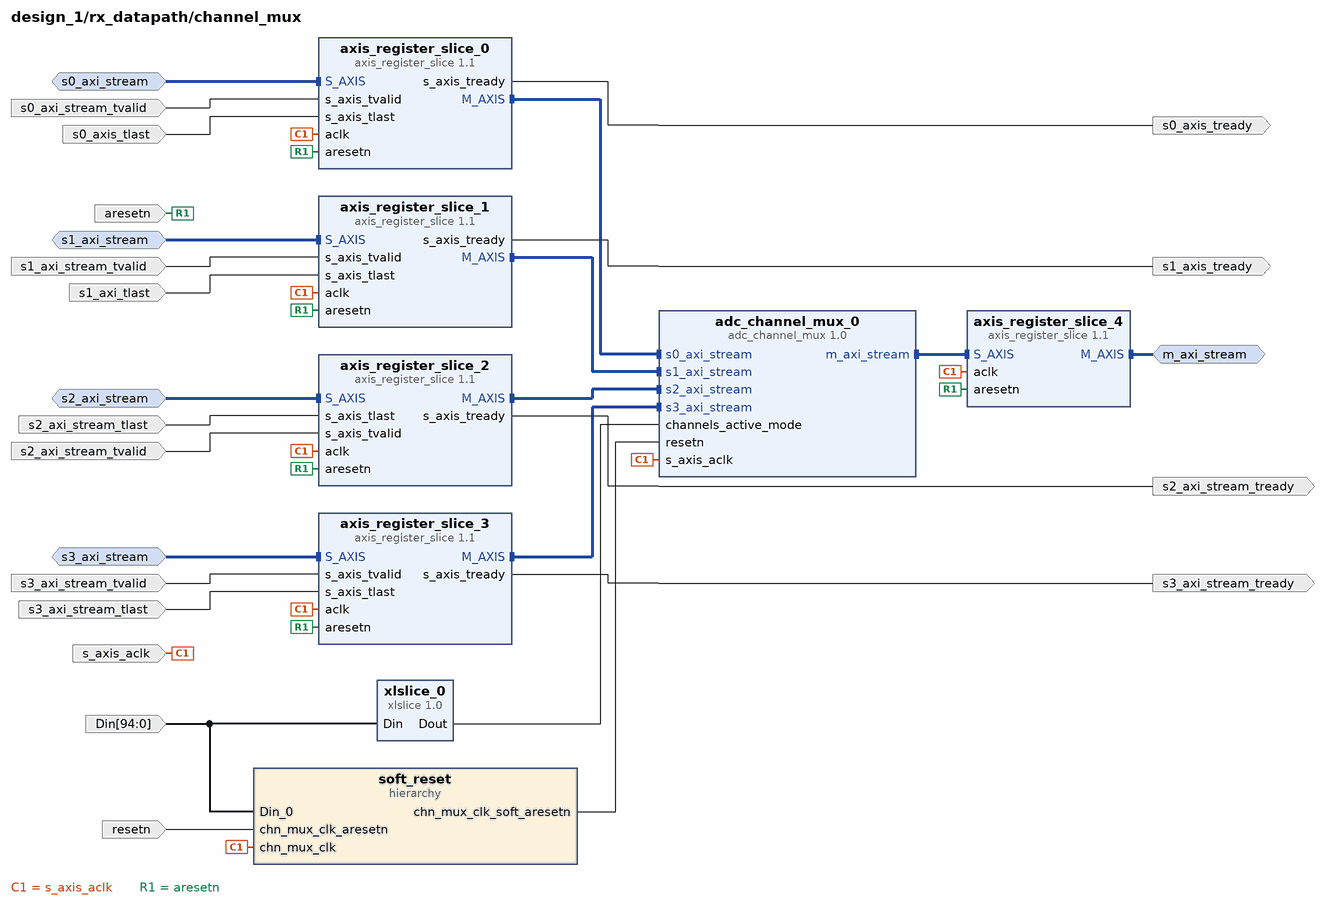
[diagram p14: block diagram inside /rx_datapath/channel_mux]
create_bd_intf_pin -mode Master -vlnv xilinx.com:interface:axis_rtl:1.0 m_axi_stream
create_bd_intf_pin -mode Slave -vlnv xilinx.com:interface:axis_rtl:1.0 s2_axi_stream
create_bd_intf_pin -mode Slave -vlnv xilinx.com:interface:axis_rtl:1.0 s3_axi_stream
create_bd_intf_pin -mode Slave -vlnv xilinx.com:interface:axis_rtl:1.0 s1_axi_stream
create_bd_intf_pin -mode Slave -vlnv xilinx.com:interface:axis_rtl:1.0 s0_axi_stream
create_bd_pin -dir I -type clk s_axis_aclk
create_bd_pin -dir I -type rst resetn
create_bd_pin -dir I s2_axi_stream_tvalid
create_bd_pin -dir I s2_axi_stream_tlast
create_bd_pin -dir O s2_axi_stream_tready
create_bd_pin -dir I s3_axi_stream_tvalid
create_bd_pin -dir I s3_axi_stream_tlast
create_bd_pin -dir O s3_axi_stream_tready
create_bd_pin -dir I -from 94 -to 0 Din
create_bd_pin -dir I s1_axi_stream_tvalid
create_bd_pin -dir I s0_axi_stream_tvalid
create_bd_pin -dir O s0_axis_tready
create_bd_pin -dir O s1_axis_tready
create_bd_pin -dir I s1_axi_tlast
create_bd_pin -dir I s0_axis_tlast
create_bd_pin -dir I -type rst aresetn

create_bd_cell -type ip -vlnv user.org:user:adc_channel_mux:1.0 adc_channel_mux_0
set_property -dict {CONFIG.AXIS_TDATA_WIDTH 512} [get_bd_cells adc_channel_mux_0]
create_bd_cell -type ip -vlnv xilinx.com:ip:xlslice:1.0 xlslice_0
set_property -dict {CONFIG.DIN_FROM 73 CONFIG.DIN_TO 42 CONFIG.DIN_WIDTH 95 CONFIG.DOUT_WIDTH 32} [get_bd_cells xlslice_0]
create_bd_cell -type hier soft_reset
create_bd_cell -type ip -vlnv xilinx.com:ip:axis_register_slice:1.1 axis_register_slice_4
create_bd_cell -type ip -vlnv xilinx.com:ip:axis_register_slice:1.1 axis_register_slice_2
create_bd_cell -type ip -vlnv xilinx.com:ip:axis_register_slice:1.1 axis_register_slice_3
create_bd_cell -type ip -vlnv xilinx.com:ip:axis_register_slice:1.1 axis_register_slice_0
create_bd_cell -type ip -vlnv xilinx.com:ip:axis_register_slice:1.1 axis_register_slice_1

# ---- hierarchy /rx_datapath/channel_mux/soft_reset ----
current_bd_instance /rx_datapath/channel_mux/soft_reset
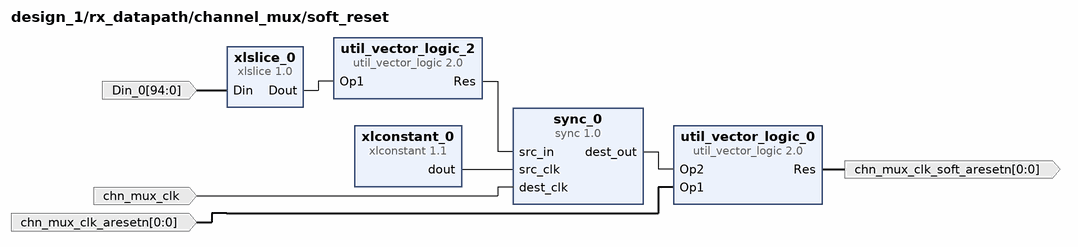
[diagram p15: block diagram inside /rx_datapath/channel_mux/soft_reset]
create_bd_pin -dir I -from 94 -to 0 Din_0
create_bd_pin -dir I -type clk chn_mux_clk
create_bd_pin -dir O -from 0 -to 0 chn_mux_clk_soft_aresetn
create_bd_pin -dir I -from 0 -to 0 chn_mux_clk_aresetn

create_bd_cell -type ip -vlnv xilinx.com:ip:xlslice:1.0 xlslice_0
set_property -dict {CONFIG.DIN_FROM 74 CONFIG.DIN_TO 74 CONFIG.DIN_WIDTH 95 CONFIG.DOUT_WIDTH 1} [get_bd_cells xlslice_0]
create_bd_cell -type ip -vlnv xilinx.com:user:sync:1.0 sync_0
set_property -dict {CONFIG.SRC_INPUT_REG 0} [get_bd_cells sync_0]
create_bd_cell -type ip -vlnv xilinx.com:ip:xlconstant:1.1 xlconstant_0
set_property -dict {CONFIG.CONST_VAL 0} [get_bd_cells xlconstant_0]
create_bd_cell -type ip -vlnv xilinx.com:ip:util_vector_logic:2.0 util_vector_logic_2
set_property -dict {CONFIG.C_OPERATION not CONFIG.C_SIZE 1} [get_bd_cells util_vector_logic_2]
create_bd_cell -type ip -vlnv xilinx.com:ip:util_vector_logic:2.0 util_vector_logic_0
set_property -dict {CONFIG.C_SIZE 1} [get_bd_cells util_vector_logic_0]

# ---- hierarchy /rx_datapath/soft_reset ----
current_bd_instance /rx_datapath/soft_reset
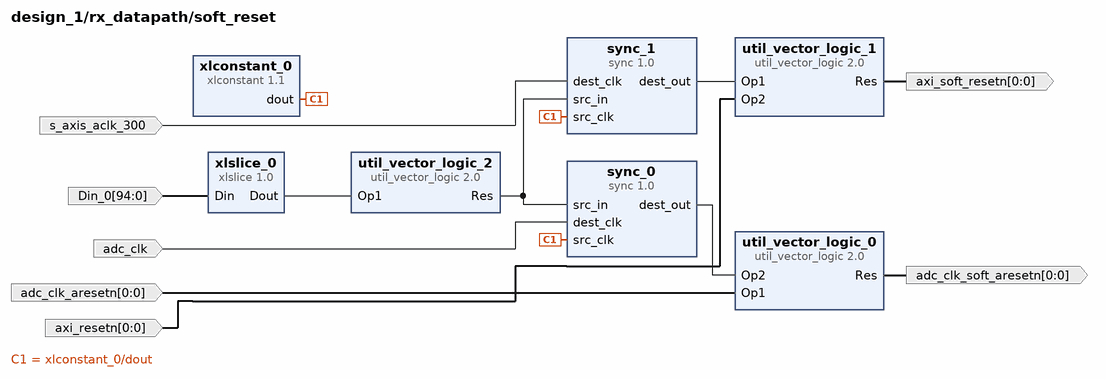
[diagram p16: block diagram inside /rx_datapath/soft_reset]
create_bd_pin -dir I -from 94 -to 0 Din_0
create_bd_pin -dir I -type clk adc_clk
create_bd_pin -dir I -type clk s_axis_aclk_300
create_bd_pin -dir O -from 0 -to 0 adc_clk_soft_aresetn
create_bd_pin -dir O -from 0 -to 0 axi_soft_resetn
create_bd_pin -dir I -from 0 -to 0 adc_clk_aresetn
create_bd_pin -dir I -from 0 -to 0 axi_resetn

create_bd_cell -type ip -vlnv xilinx.com:ip:xlslice:1.0 xlslice_0
set_property -dict {CONFIG.DIN_FROM 29 CONFIG.DIN_TO 29 CONFIG.DIN_WIDTH 95 CONFIG.DOUT_WIDTH 1} [get_bd_cells xlslice_0]
create_bd_cell -type ip -vlnv xilinx.com:user:sync:1.0 sync_0
set_property -dict {CONFIG.SRC_INPUT_REG 0} [get_bd_cells sync_0]
create_bd_cell -type ip -vlnv xilinx.com:user:sync:1.0 sync_1
set_property -dict {CONFIG.SRC_INPUT_REG 0} [get_bd_cells sync_1]
create_bd_cell -type ip -vlnv xilinx.com:ip:xlconstant:1.1 xlconstant_0
set_property -dict {CONFIG.CONST_VAL 0} [get_bd_cells xlconstant_0]
create_bd_cell -type ip -vlnv xilinx.com:ip:util_vector_logic:2.0 util_vector_logic_2
set_property -dict {CONFIG.C_OPERATION not CONFIG.C_SIZE 1} [get_bd_cells util_vector_logic_2]
create_bd_cell -type ip -vlnv xilinx.com:ip:util_vector_logic:2.0 util_vector_logic_0
set_property -dict {CONFIG.C_SIZE 1} [get_bd_cells util_vector_logic_0]
create_bd_cell -type ip -vlnv xilinx.com:ip:util_vector_logic:2.0 util_vector_logic_1
set_property -dict {CONFIG.C_SIZE 1} [get_bd_cells util_vector_logic_1]
